# EasyEDA Pro project OctoSlime_Base_Unit_Light.eprj

# Schematic Octoslime

## Sheets
1 I2C breakout and OLED
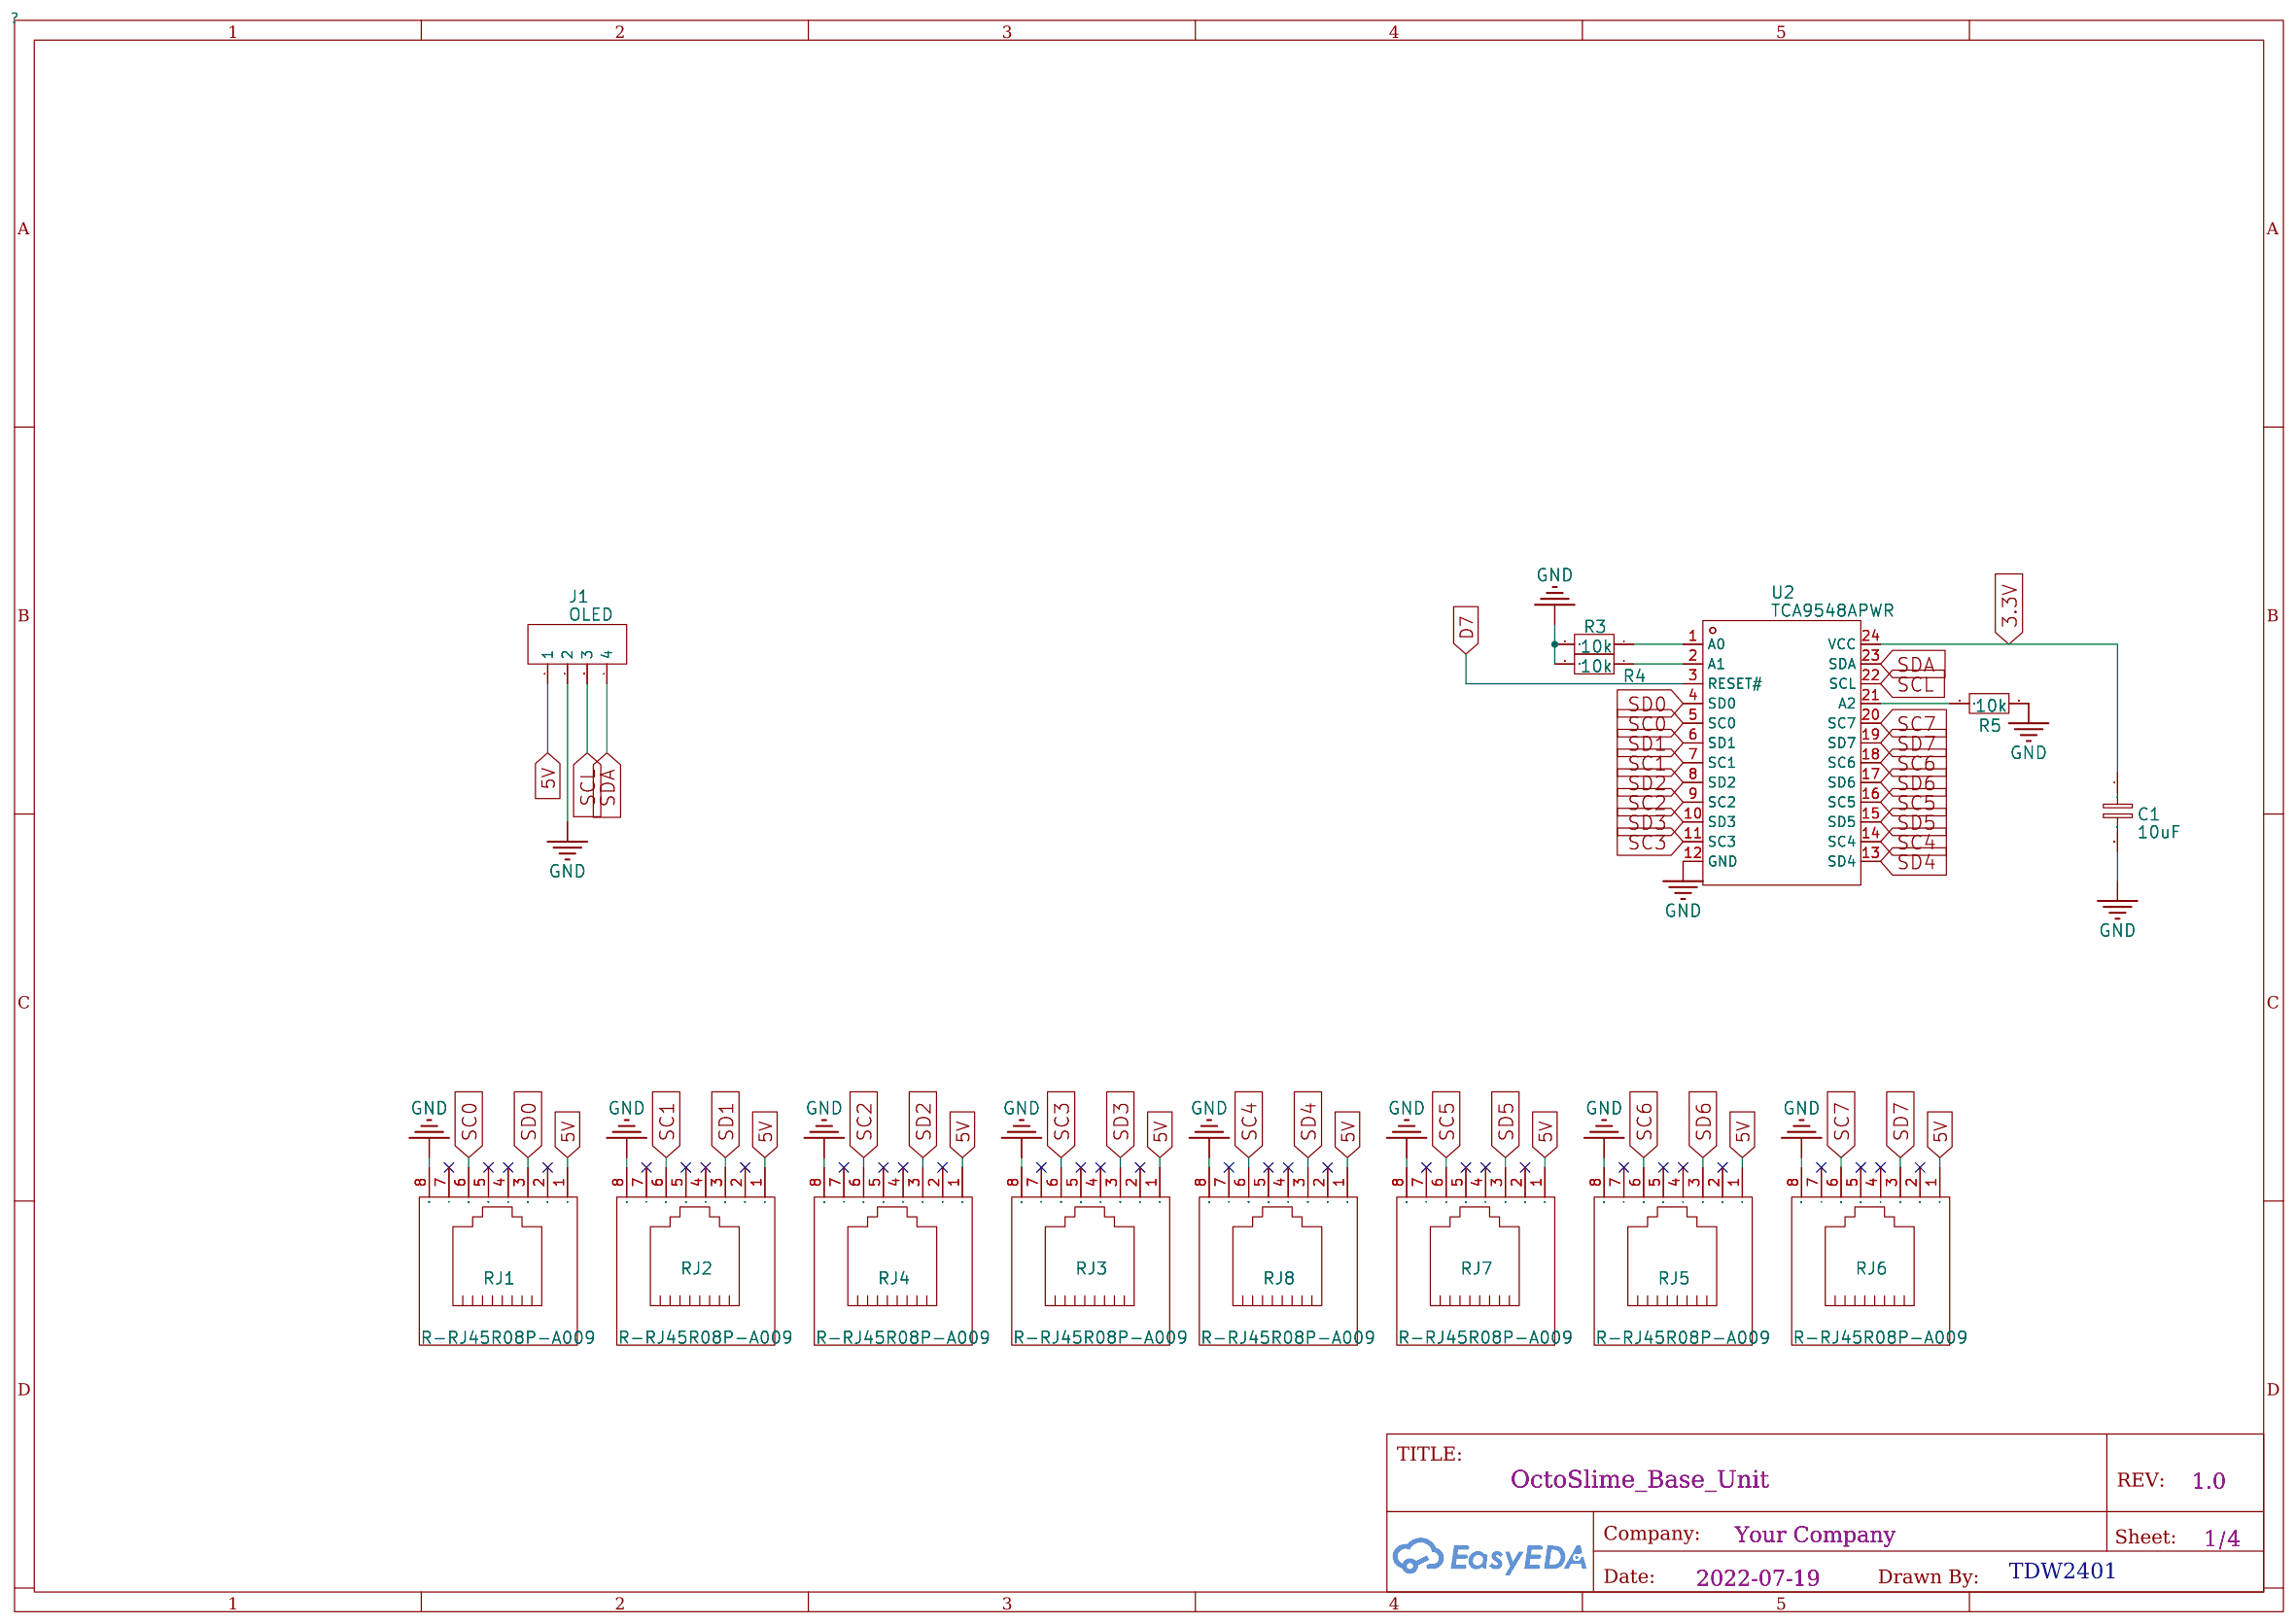
[diagram p0: I2C breakout and OLED]
2 Charge / data
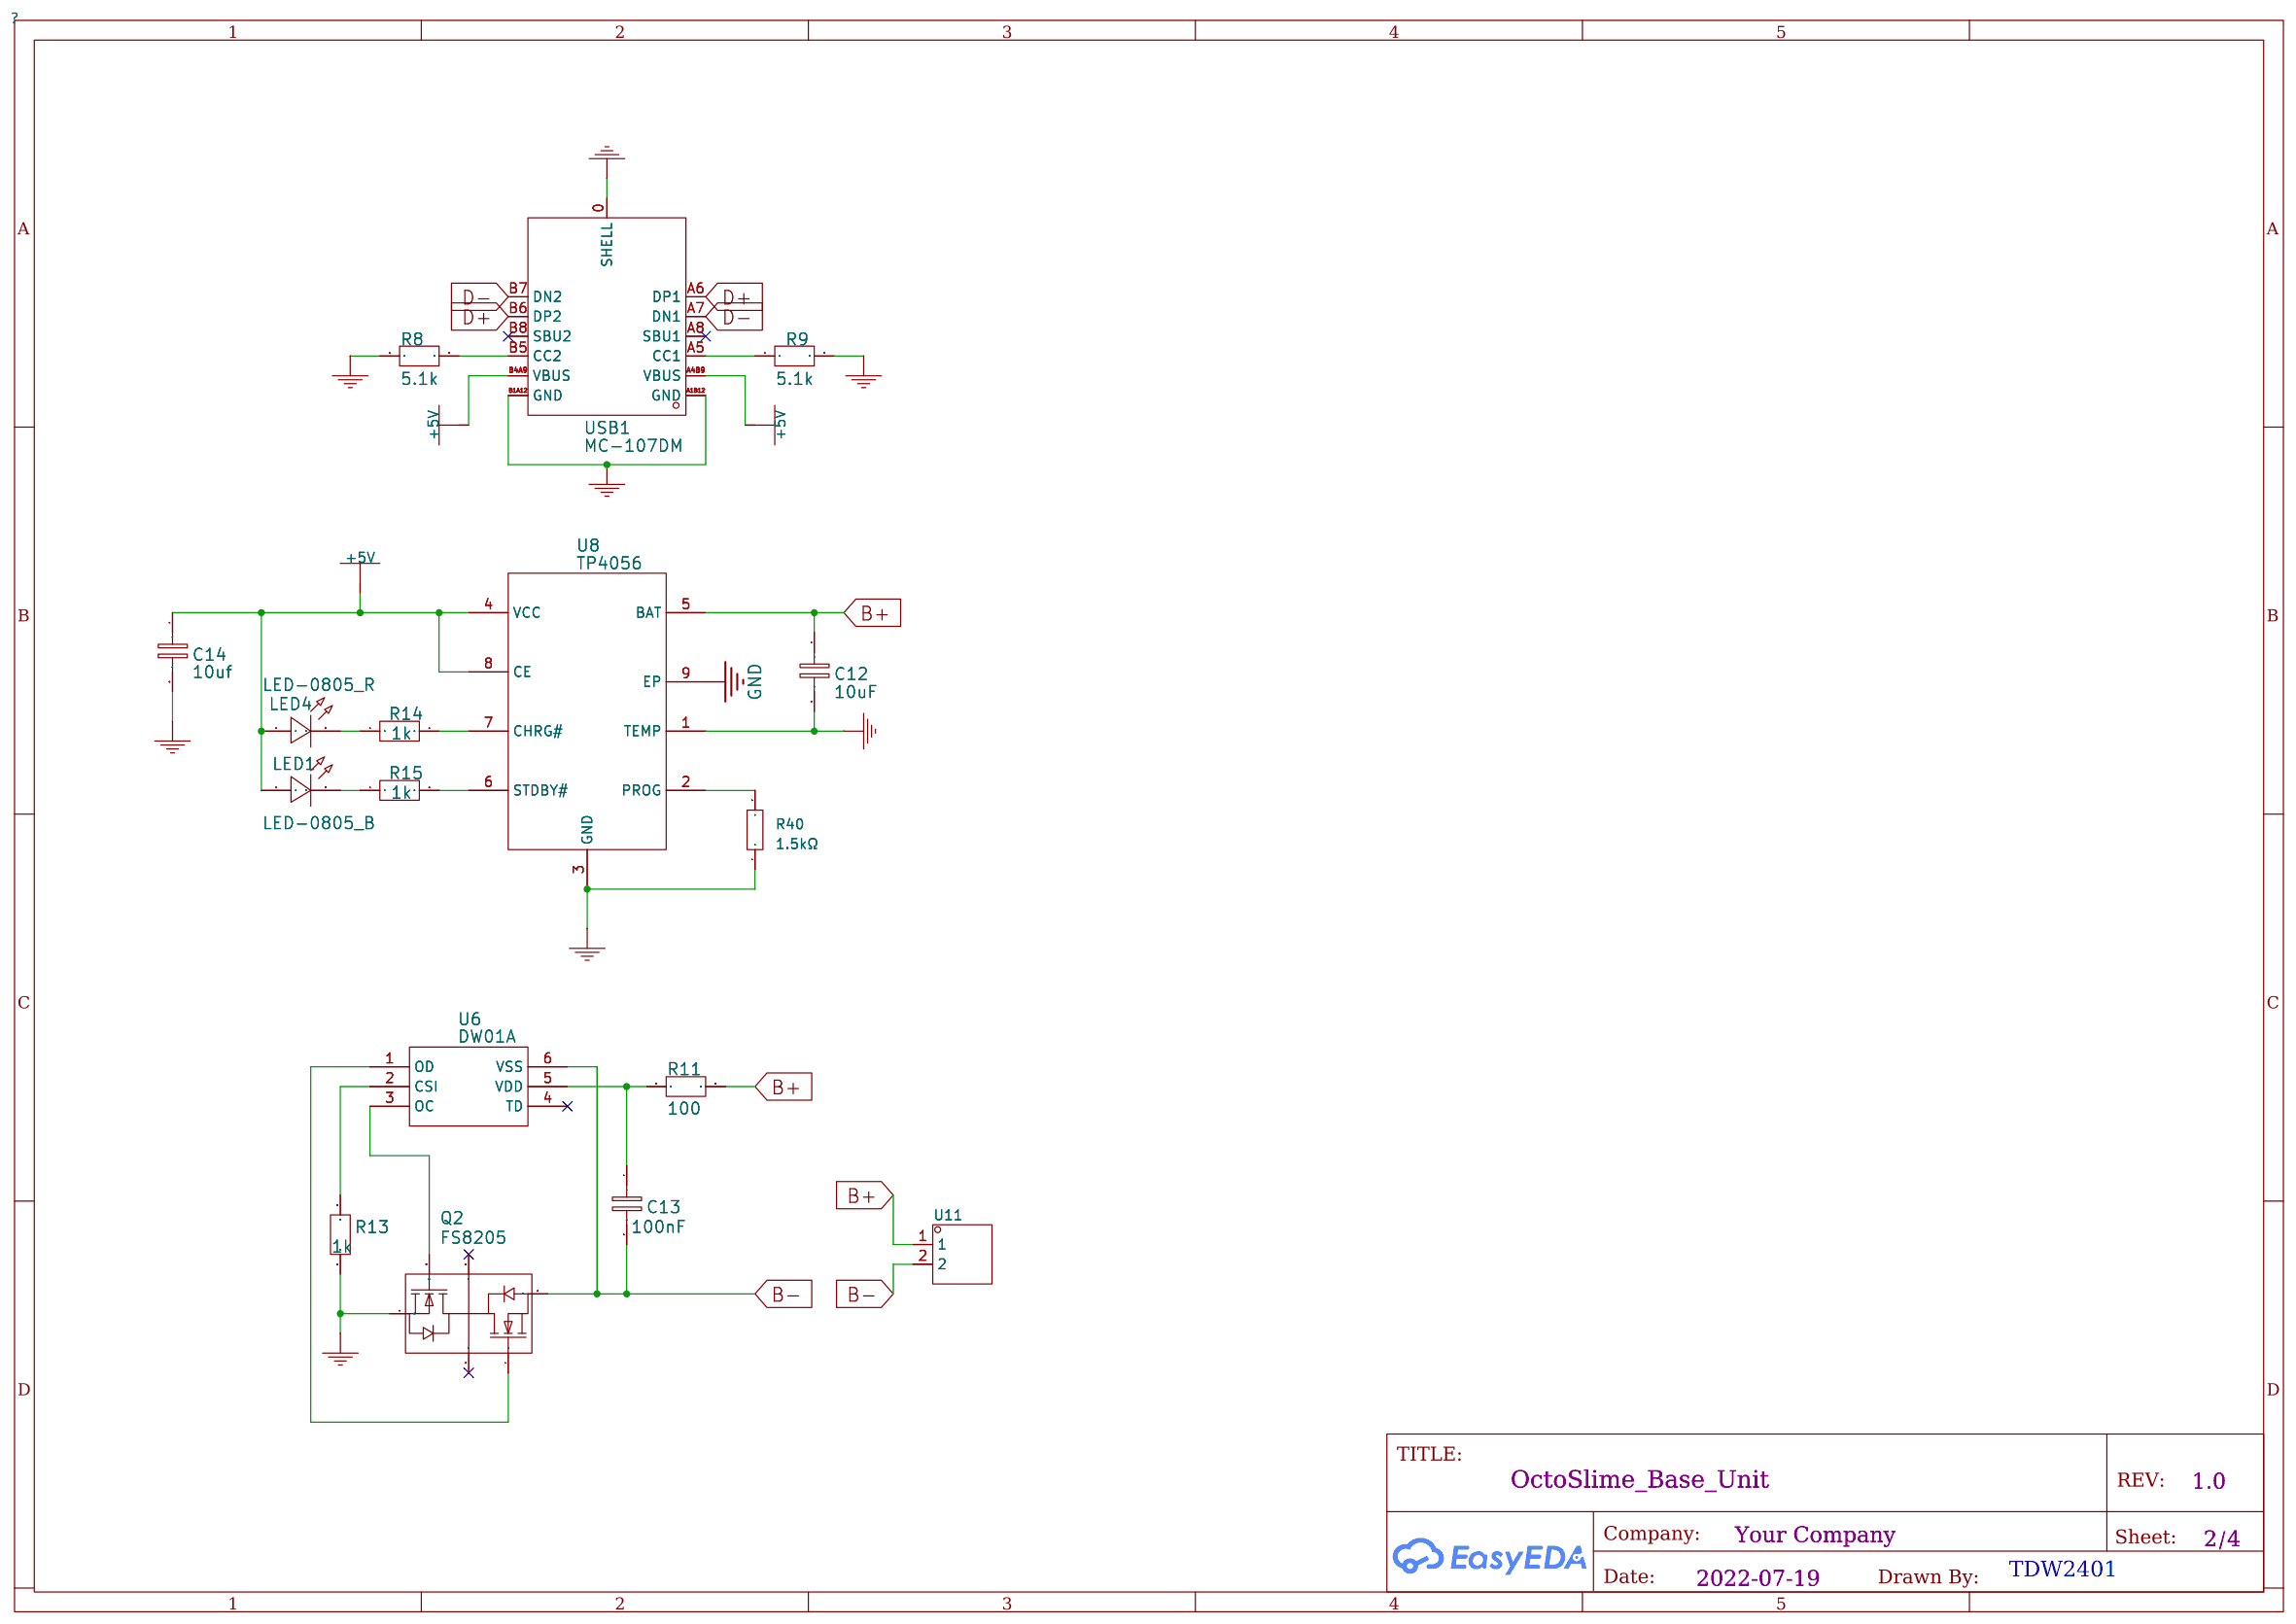
[diagram p1: Charge / data]
3 MCU
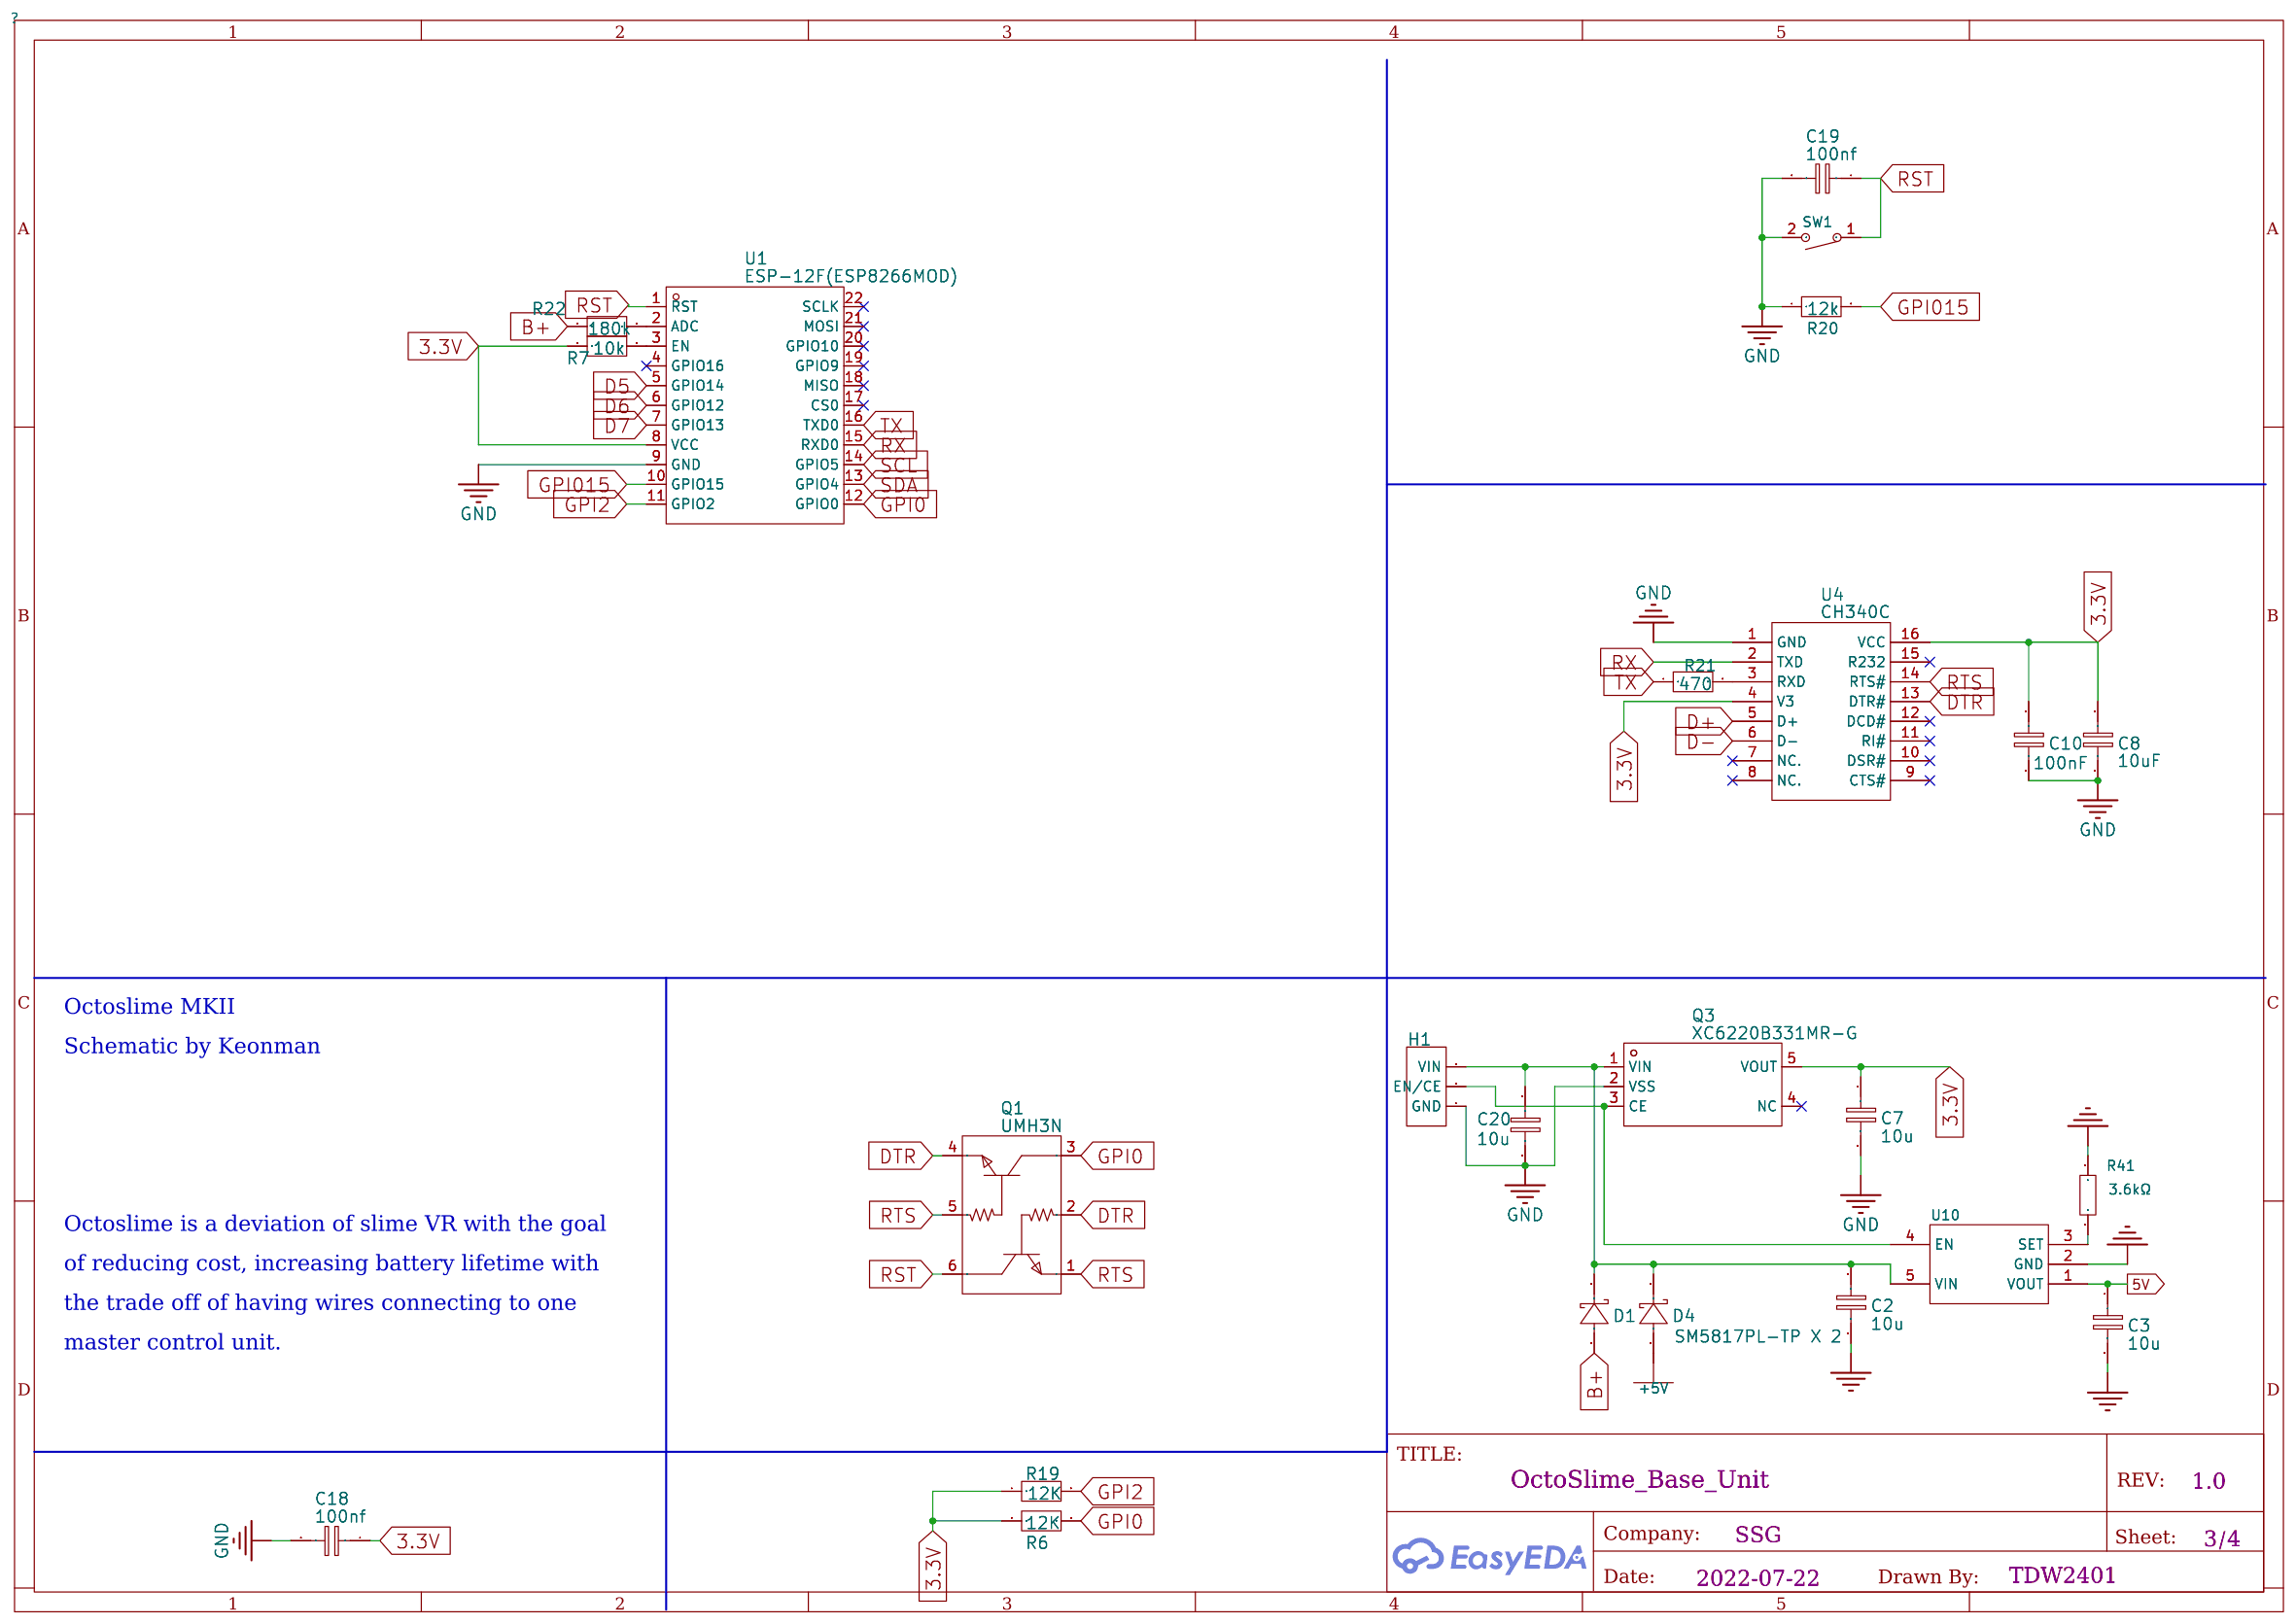
[diagram p2: MCU]
4 I2C thing - ma - jigXC6220B331PR-G
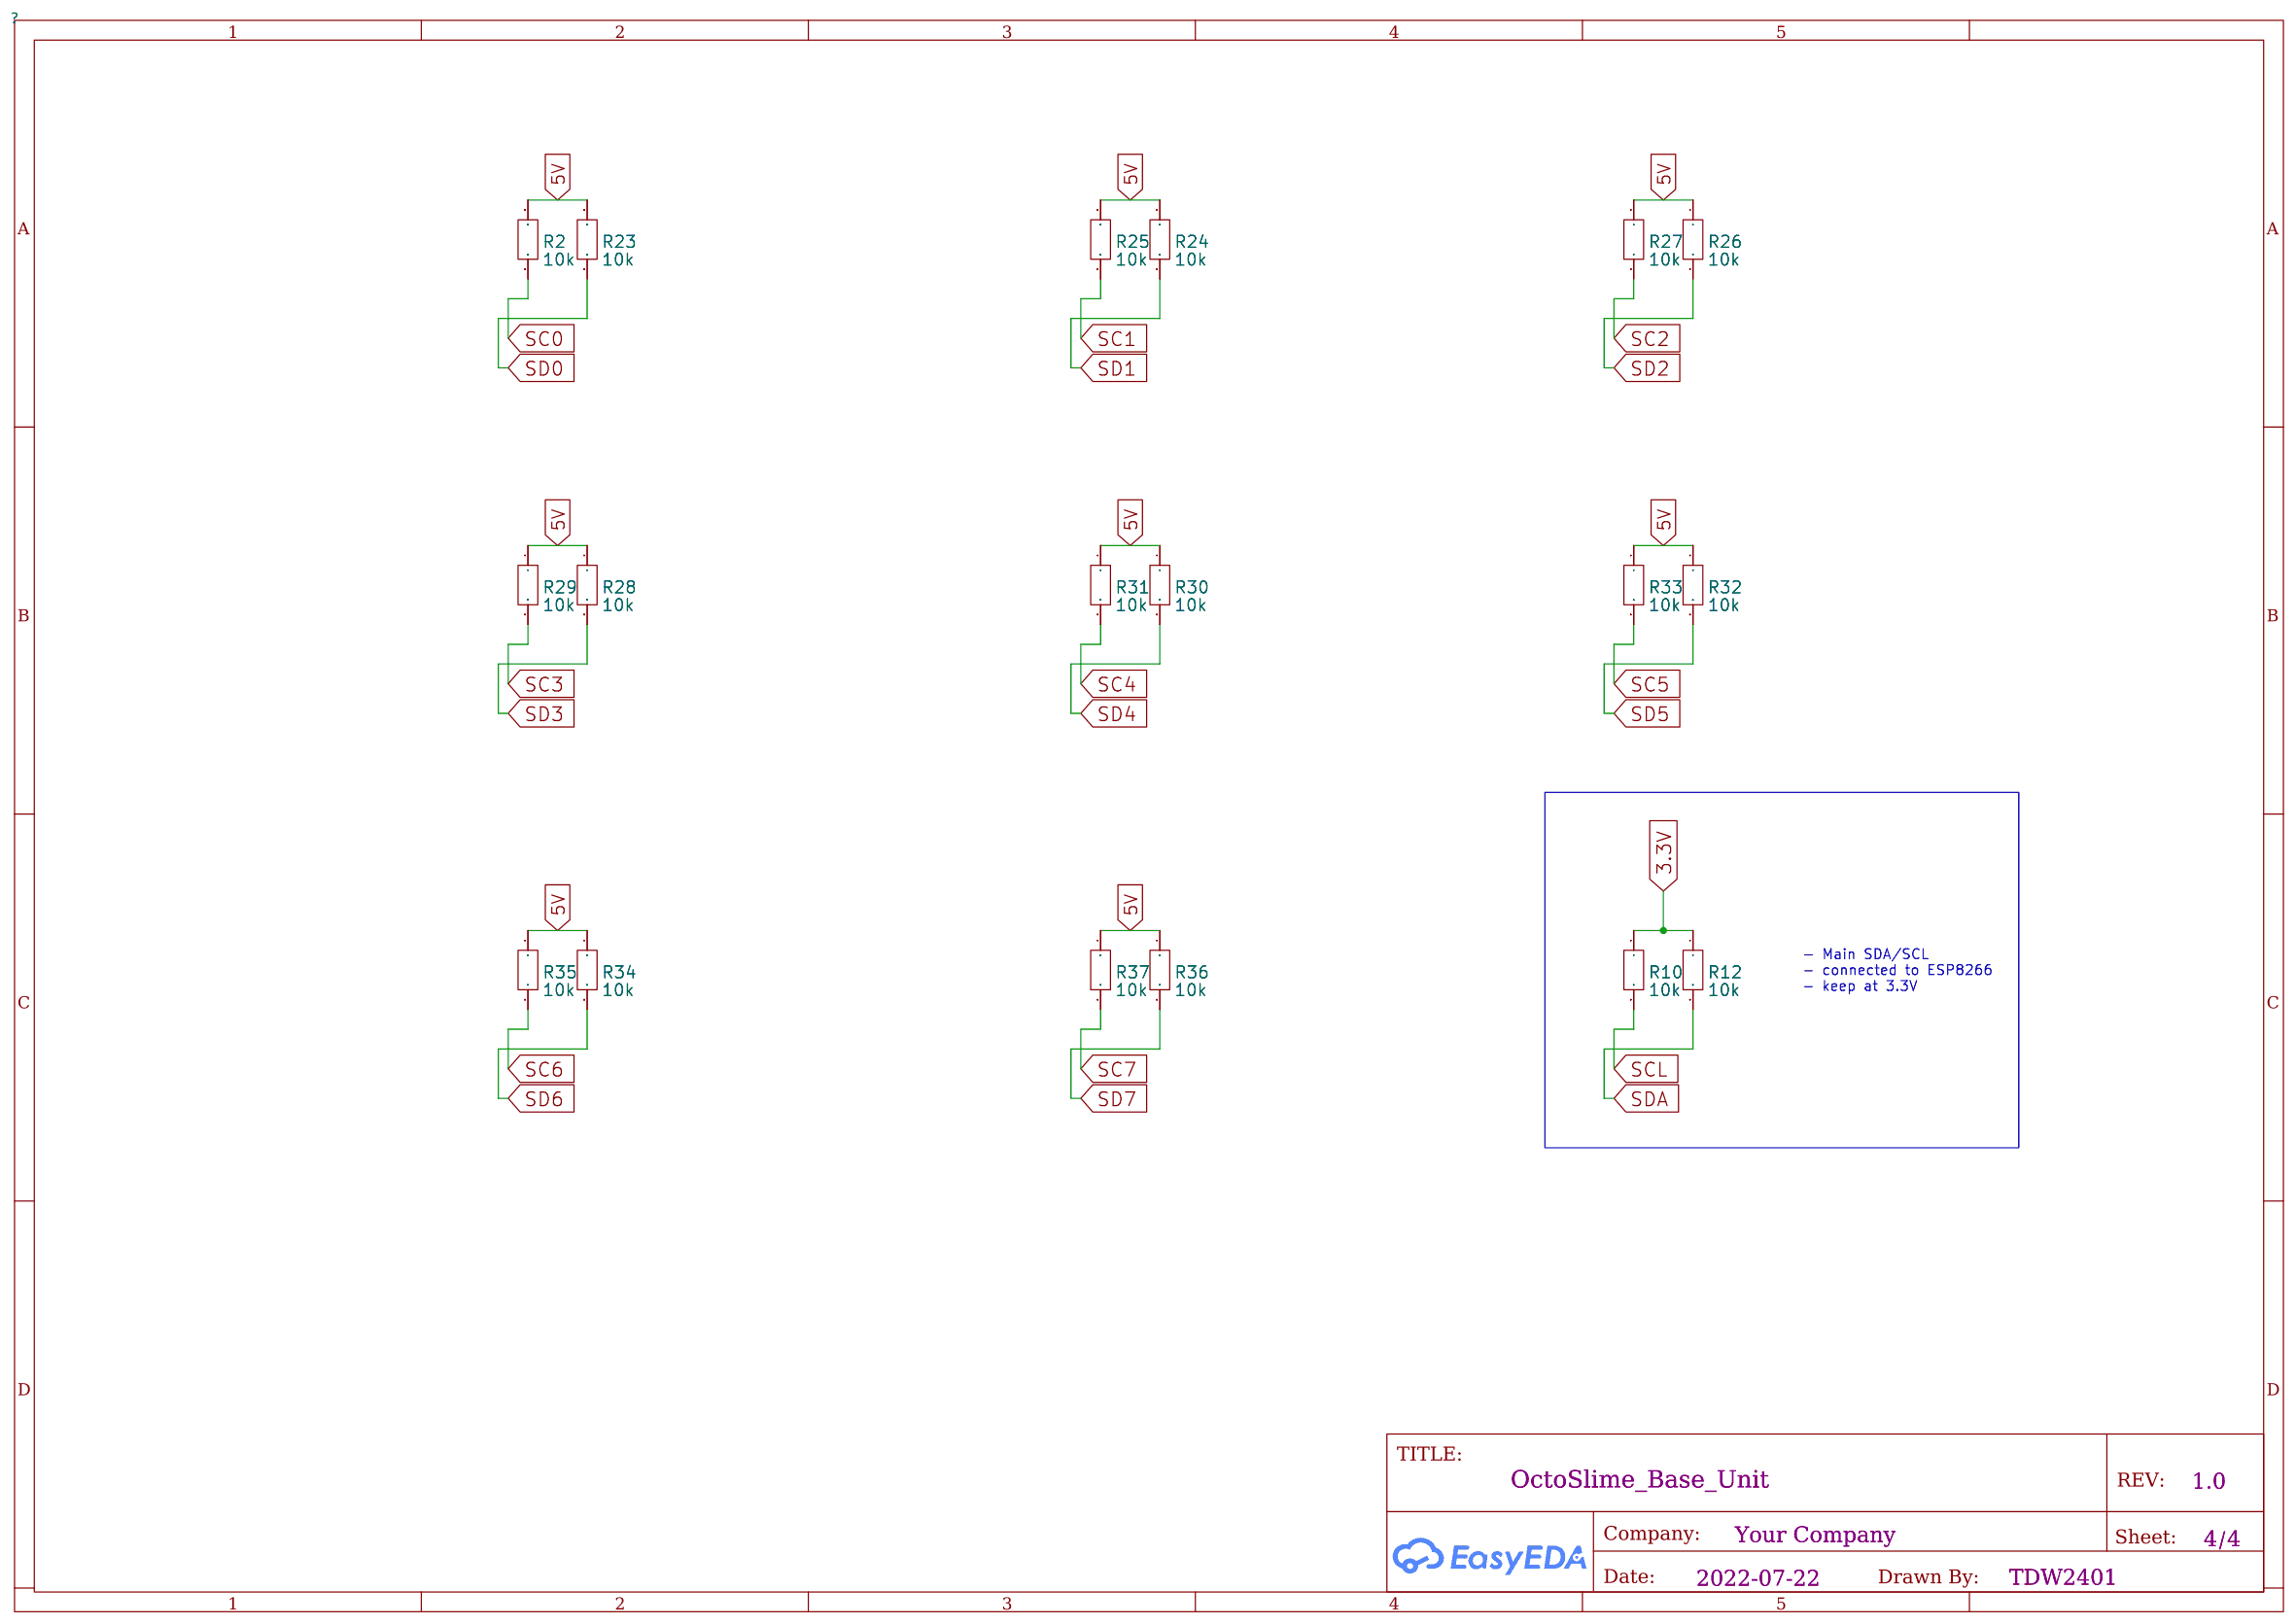
[diagram p3: I2C thing - ma - jigXC6220B331PR-G]

## Parts
sheet Charge / data
C12  10uF  [C0805]
C13  100nF  [C0805]
C14  10uf  [C0805]
LED1  LED-0805_B  [LED0805_BLUE]
LED4  LED-0805_R  [LED0805_RED]
Q2  FS8205  [SOT-23-6_L2.9-W1.6-P0.95-LS2.8-BR]
R8  5.1k  [R0805]
R9  5.1k  [R0805]
R11  100  [R0805]
R13  1k  [R0805]
R14  1k  [R0805]
R15  1k  [R0805]
R40  1.5kΩ  [R0805]
U6  DW01A  [SOT-23-6_L2.9-W1.6-P0.95-LS2.8-BL]
U8  TP4056  [ESOP-8_L4.9-W3.9-P1.27-LS6.0-BL-EP]
U11  S2B-PH-K-S(LF)(SN)  [CONN-TH_S2B-PH-K-S-LF-SN]
USB1  MC-107DM  [USB-C-SMD_MC-107D]
sheet I2C breakout and OLED
C1  10uF  [C0805]
J1  OLED  [HDR-M-2.54_1X4]  (no BOM)
R3  10k  [R0805]
R4  10k  [R0805]
R5  10k  [R0805]
RJ1  R-RJ45R08P-A009  [RJ45-TH_R-RJ45R08P-A009]
RJ2  R-RJ45R08P-A009  [RJ45-TH_R-RJ45R08P-A009]
RJ3  R-RJ45R08P-A009  [RJ45-TH_R-RJ45R08P-A009]
RJ4  R-RJ45R08P-A009  [RJ45-TH_R-RJ45R08P-A009]
RJ5  R-RJ45R08P-A009  [RJ45-TH_R-RJ45R08P-A009]
RJ6  R-RJ45R08P-A009  [RJ45-TH_R-RJ45R08P-A009]
RJ7  R-RJ45R08P-A009  [RJ45-TH_R-RJ45R08P-A009]
RJ8  R-RJ45R08P-A009  [RJ45-TH_R-RJ45R08P-A009]
U2  TCA9548APWR  [TSSOP-24_L7.8-W4.4-P0.65-LS6.4-BL]
sheet I2C thing - ma - jigXC6220B331PR-G
R2  10k  [R0805]
R10  10k  [R0805]
R12  10k  [R0805]
R23  10k  [R0805]
R24  10k  [R0805]
R25  10k  [R0805]
R26  10k  [R0805]
R27  10k  [R0805]
R28  10k  [R0805]
R29  10k  [R0805]
R30  10k  [R0805]
R31  10k  [R0805]
R32  10k  [R0805]
R33  10k  [R0805]
R34  10k  [R0805]
R35  10k  [R0805]
R36  10k  [R0805]
R37  10k  [R0805]
sheet MCU
C2  10u  [C0805]
C3  10u  [C0805]
C7  10u  [C0805]
C8  10uF  [C0805]
C10  100nF  [C0805]
C18  100nf  [C0805]
C19  100nf  [C0805]
C20  10u  [C0805]
D1  SM5817PL-TP X 2  [SOD-123FL_L2.8-W1.7-LS3.6-RD]
D4  SM5817PL-TP X 2  [SOD-123FL_L2.8-W1.7-LS3.6-RD]
H1  HDR-F-2.54_1x3  [HDR-F-2.54_1X3]  (no BOM)
Q1  UMH3N  [SC-70-6_L2.2-W1.3-P0.65-LS2.1-BR]
Q3  XC6220B331MR-G  [SOT-25-5_L3.0-W1.8-P0.95-LS3.0-BR]
R6  12K  [R0805]
R7  10k  [R0805]
R19  12K  [R0805]
R20  12k  [R0805]
R21  470  [R0805]
R22  180k  [R0805]
R41  3.6kΩ  [R0805]
SW1  -  [SW-SMD_L4.0-W2.9-LS5.0]
U1  ESP-12F(ESP8266MOD)  [WIFIM-SMD_ESP-12F-ESP8266MOD]
U4  CH340C  [SOP-16_L10.0-W3.9-P1.27-LS6.0-BL]
U10  MT9700  [SOT-23-5_L3.0-W1.7-P0.95-LS2.8-BR]

## Library data of the parts
C1 C8 C12 = 10uF: link: https://item.szlcsc.com/373011.html; 3DModel: C0805_L2.0-W1.3-H1.3
C10 C13 = 100nF: link: https://item.szlcsc.com/373011.html; 3DModel: C0805_L2.0-W1.3-H1.3
C14 = 10uf: link: https://item.szlcsc.com/373011.html; 3DModel: C0805_L2.0-W1.3-H1.3
LED1 = LED-0805_B: 3DModel: LED0805_Blue; Manufacturer: 方舟 ARKLED; Manufacturer Part: D-B080508B1-KS2; Supplier Part: C108412
LED4 = LED-0805_R: 3DModel: LED0805_Red; Manufacturer: EVERLIGHT(台湾亿光); Manufacturer Part: 17-21SURC/S530-A3/TR8; Supplier Part: C72037
Q2 = FS8205: link: https://item.szlcsc.com/169042.html; 3DModel: SOT-23-6_L2.9-W1.6-H1.5-LS2.8-P0.95; Supplier: LCSC; Manufacturer: FORTUNE; Supplier Part: C32254; JLCPCB Part Class: Extended Part
R8 R9 = 5.1k: link: https://item.szlcsc.com/142685.html; 3DModel: R0805_L2.0-W1.3-H0.6
R11 = 100: link: https://item.szlcsc.com/142685.html; 3DModel: R0805_L2.0-W1.3-H0.6
R13-R15 = 1k: link: https://item.szlcsc.com/142685.html; 3DModel: R0805_L2.0-W1.3-H0.6
R40 = 0805W8F1501T5E: 电阻类型:厚膜电阻;阻值:1.5kΩ;精度:±1%;功率:125mW;温度系数:±100ppm/;最大工作电压:150V;工作温度范围:-55~+155;; LCSC Part Name: 1.5kΩ ±1% 125mW; Supplier Part: C4310; Manufacturer: UNI-ROYAL(厚声); Supplier Footprint: 0805; JLCPCB Part Class: Basic Part; Datasheet: https://atta.szlcsc.com/upload/public/pdf/source/20200306/C422600_1E6D84923E4A46A82E41ADD87F860B5C.pdf; Supplier: LCSC; Type: 厚膜电阻; Tolerance: ±1%; Power(Watts): 125mW; Temperature Coefficient: ±100ppm/; Overload Voltage (Max): 150V; Operating Temperature Range: -55~+155
U6 = DW01A: link: https://item.szlcsc.com/169042.html; 3DModel: SOT-23-6_L2.9-W1.6-H1.5-LS2.8-P0.95; Supplier: LCSC; Manufacturer: FM; Supplier Part: C85680; JLCPCB Part Class: Extended Part
U8 = TP4056: link: https://www.mornsun.cn/html/pdf/SCM1501B.html; 3DModel: ESOP-8_L4.9-W3.9-H1.6-LS6.0-P1.27; Supplier: LCSC; Manufacturer: TOPPOWER; Supplier Part: C16581; JLCPCB Part Class: Basic Part
U11 = S2B-PH-K-S(LF)(SN): 参考系列:PH;间距:2mm;插针结构:1x2P;排数:1;每排PIN数:2;行距:-;安装方式:-;触头材质:黄铜;; LCSC Part Name: PH系列插座 1*2P 间距2mm 弯针 打K; Supplier Part: C173752; Manufacturer: JST; Supplier Footprint: 插件,P=2mm; JLCPCB Part Class: Extended Part; Datasheet: https://atta.szlcsc.com/upload/public/pdf/source/20180327/C173752_5C91EDA4B54CB1D33BA17C4D2B983D44.pdf; Supplier: LCSC; Reference Series: PH; Pitch: 2mm; Pins Structure: 1x2P; Number of Rows: 1; Number of PINs Per Row: 2; Contact Material: 黄铜
USB1 = MC-107DM: link: https://atta.szlcsc.com/upload/public/pdf/source/20210810/6DD818F077A767CCD2FDFBDED48F58DC.pdf; Supplier: LCSC; Supplier Part: C2874569; Manufacturer: 台湾汉博; JLCPCB Part Class: Extended Part
J1 = OLED: 3DModel: HDR-M-2.54_1x4; Supplier Part: C124378; Supplier: LCSC
R2-R5 R7 R10 R12 R23-R37 = 10k: link: https://item.szlcsc.com/142685.html; 3DModel: R0805_L2.0-W1.3-H0.6
RJ1-RJ8 = R-RJ45R08P-A009: link: https://atta.szlcsc.com/upload/public/pdf/source/20211021/D54662BD8381AD1D1DF920996089EE18.pdf; Supplier: LCSC; Supplier Part: C2902700; Manufacturer: Ckmtw(灿科盟); JLCPCB Part Class: Extended Part
U2 = TCA9548APWR: link: https://item.szlcsc.com/6601.html; 3DModel: TSSOP-24_L7.8-W4.4-H1.0-LS6.4-P0.65; Supplier: LCSC; Manufacturer: TI; Supplier Part: C130026; JLCPCB Part Class: Extended Part
C2 C3 C7 C20 = 10u: link: https://item.szlcsc.com/373011.html; 3DModel: C0805_L2.0-W1.3-H1.3
C18 C19 = 100nf: link: https://item.szlcsc.com/373011.html; 3DModel: C0805_L2.0-W1.3-H1.3
D1 D4 = SM5817PL-TP X 2: link: https://item.szlcsc.com/771782.html; Supplier: LCSC; Supplier Part: C669022; Manufacturer: MCC(Micro Commercial Components); Manufacturer Part: SM5817PL-TP; JLCPCB Part Class: Extended Part
H1 = HDR-F-2.54_1x3: link: https://www.cjt.com/Upload/A2541.pdf; Supplier Part: C146690; Supplier: LCSC
Q1 = UMH3N: link: https://item.szlcsc.com/112963.html; 3DModel: SC-70-6_L2.1-W1.3-H1.0-LS2.1-P0.65; Supplier: LCSC; Manufacturer: CJ; Supplier Part: C62892; JLCPCB Part Class: Extended Part
Q3 = XC6220B331MR-G: link: https://item.szlcsc.com/70677.html; 3DModel: SOT-25-5_L3.0-W1.6-H1.3-LS2.8-P0.95; Supplier: LCSC; Manufacturer: TOREX; Supplier Part: C86534; JLCPCB Part Class: Extended Part
R6 R19 = 12K: link: https://item.szlcsc.com/142685.html; 3DModel: R0805_L2.0-W1.3-H0.6
R20 = 12k: link: https://item.szlcsc.com/142685.html; 3DModel: R0805_L2.0-W1.3-H0.6
R21 = 470: link: https://item.szlcsc.com/142685.html; 3DModel: R0805_L2.0-W1.3-H0.6
R22 = 180k: link: https://item.szlcsc.com/142685.html; 3DModel: R0805_L2.0-W1.3-H0.6
R41 = 0805W8F3601T5E: 电阻类型:厚膜电阻;阻值:3.6kΩ;精度:±1%;功率:1/8W;温度系数:±100ppm/;最大工作电压:150V;工作温度范围:-55~+155;; LCSC Part Name: 3.6kΩ ±1%; Supplier Part: C18359; Manufacturer: UNI-ROYAL(厚声); Supplier Footprint: 0805; JLCPCB Part Class: Basic Part; Datasheet: https://atta.szlcsc.com/upload/public/pdf/source/20200306/C422600_1E6D84923E4A46A82E41ADD87F860B5C.pdf; Supplier: LCSC; Type: 厚膜电阻; Tolerance: ±1%; Power(Watts): 1/8W; Temperature Coefficient: ±100ppm/; Overload Voltage (Max): 150V; Operating Temperature Range: -55~+155
SW1 = TS342A2P-WZ: LCSC Part Name: 轻触开关 3*4*2 两脚小龟不带柱 250gf 黑色塑胶按钮; Supplier Part: C557591; Manufacturer: SHOU HAN(首韩); Supplier Footprint: SMD; JLCPCB Part Class: Extended Part; Datasheet: https://atta.szlcsc.com/upload/public/pdf/source/20200519/C557591_B3A5A21584733303F06306F18577DA8B.pdf; Supplier: LCSC
U1 = ESP-12F(ESP8266MOD): link: https://item.szlcsc.com/84052.html; 3DModel: WIFIM-SMD_WIFI-L24.0-W16.0-H3.1; Supplier: LCSC; Manufacturer: Ai-Thinker; Supplier Part: C82891; JLCPCB Part Class: Extended Part
U4 = CH340C: link: https://item.szlcsc.com/391677.html; Supplier Part: C84681; Supplier: LCSC; 3DModel: SOP-16_L9.9-W3.9-H1.5-LS6.0-P1.27; Manufacturer: WCH; JLCPCB Part Class: Extended Part
U10 = MT9700: 低功耗负载开关/USB电源开关/限流保护开关; Supplier Part: C89855; Manufacturer: 西安航天民芯; Supplier Footprint: SOT-23-5; JLCPCB Part Class: Extended Part; Datasheet: https://atta.szlcsc.com/upload/public/pdf/source/20170418/1492481333031.pdf; Supplier: LCSC

## Nets
3.3V: C1.1 C7.1 C8.1 C10.1 C18.1 Q3.5(VOUT) R6.1 R7.1 R10.1 R12.1 R19.1 U1.8(VCC) U2.24(VCC) U4.4(V3) U4.16(VCC)
5V: C3.1 J1.1 R2.1 R23.1 R24.1 R25.1 R26.1 R27.1 R28.1 R29.1 R30.1 R31.1 R32.1 R33.1 R34.1 R35.1 R36.1 R37.1 RJ1.1 RJ2.1 RJ3.1 RJ4.1 RJ5.1 RJ6.1 RJ7.1 RJ8.1 U10.1(VOUT)
+5V: C14.1 D4.2(A) LED1.1 LED4.1 U8.4(VCC) U8.8(CE) USB1.A4B9(VBUS) USB1.B4A9(VBUS)
GND: C1.2 C2.2 C3.2 C7.2 C8.2 C10.2 C12.2 C14.2 C18.2 C19.2 C20.2 H1.1(GND) J1.2 Q2.1(S1) Q3.2(VSS) R3.2 R4.2 R5.1 R8.1 R9.2 R13.2 R20.1 R40.1 R41.2 RJ1.8 RJ2.8 RJ3.8 RJ4.8 RJ5.8 RJ6.8 RJ7.8 RJ8.8 SW1.2 U1.9(GND) U2.12(GND) U4.1(GND) U8.1(TEMP) U8.3(GND) U8.9(EP) U10.2(GND) USB1.0(SHELL) USB1.A1B12(GND) USB1.B1A12(GND)
B+: C12.1 D1.2(A) R11.2 R22.1 U8.5(BAT) U11.1
B-: C13.2 Q2.3(S2) U6.6(VSS) U11.2
CHRG#: R14.2 U8.7(CHRG#)
D5: U1.5(GPIO14)
D6: U1.6(GPIO12)
D7: U1.7(GPIO13) U2.3(RESET#)
D+: U4.5(D+) USB1.A6(DP1) USB1.B6(DP2)
D-: U4.6(D-) USB1.A7(DN1) USB1.B7(DN2)
DTR: Q1.2(B) Q1.4(E) U4.13(DTR#)
GPI0: Q1.3(C) R6.2 U1.12(GPIO0)
GPI2: R19.2 U1.11(GPIO2)
GPI015: R20.2 U1.10(GPIO15)
RPROG: R40.2 U8.2(PROG)
RST: C19.1 Q1.6(C) SW1.1 U1.1(RST)
RTS: Q1.1(E) Q1.5(B) U4.14(RTS#)
RX: U1.15(RXD0) U4.2(TXD)
SC0: R2.2 RJ1.6 U2.5(SC0)
SC1: R25.2 RJ2.6 U2.7(SC1)
SC2: R27.2 RJ4.6 U2.9(SC2)
SC3: R29.2 RJ3.6 U2.11(SC3)
SC4: R31.2 RJ8.6 U2.14(SC4)
SC5: R33.2 RJ7.6 U2.16(SC5)
SC6: R35.2 RJ5.6 U2.18(SC6)
SC7: R37.2 RJ6.6 U2.20(SC7)
SCL: J1.3 R10.2 U1.14(GPIO5) U2.22(SCL)
SD0: R23.2 RJ1.3 U2.4(SD0)
SD1: R24.2 RJ2.3 U2.6(SD1)
SD2: R26.2 RJ4.3 U2.8(SD2)
SD3: R28.2 RJ3.3 U2.10(SD3)
SD4: R30.2 RJ8.3 U2.13(SD4)
SD5: R32.2 RJ7.3 U2.15(SD5)
SD6: R34.2 RJ5.3 U2.17(SD6)
SD7: R36.2 RJ6.3 U2.19(SD7)
SDA: J1.4 R12.2 U1.13(GPIO4) U2.23(SDA)
STDBY#: R15.2 U8.6(STDBY#)
TX: R21.1 U1.16(TXD0)
$1N65: R4.1 U2.2(A1)
$1N66: R3.1 U2.1(A0)
$1N67: R5.2 U2.21(A2)
$2N78: R8.2 USB1.B5(CC2)
$2N79: R9.1 USB1.A5(CC1)
$2N179: LED1.2 R15.1
$2N191: LED4.2 R14.1
$2N237: Q2.6(G1) U6.3(OC)
$2N238: Q2.4(G2) U6.1(OD)
$2N249: C13.1 R11.1 U6.5(VDD)
$2N267: R13.1 U6.2(CSI)
$3N452: R7.2 U1.3(EN)
$3N457: R21.2 U4.3(RXD)
$3N474: R22.2 U1.2(ADC)
$3N12959: H1.2(EN/CE) Q3.3(CE) U10.4(EN)
$3N13001: C2.1 C20.1 D1.1(C) D4.1(C) H1.3(VIN) Q3.1(VIN) U10.5(VIN)
$3N14474: R41.1 U10.3(SET)

Not connected (* = marked no-connect by the designer): Q2 2(D12)* 5(D12)*; Q3 4(NC)*; RJ1 2* 4* 5* 7*; RJ2 2* 4* 5* 7*; RJ3 2* 4* 5* 7*; RJ4 2* 4* 5* 7*; RJ5 2* 4* 5* 7*; RJ6 2* 4* 5* 7*; RJ7 2* 4* 5* 7*; RJ8 2* 4* 5* 7*; U1 4(GPIO16)* 17(CS0)* 18(MISO)* 19(GPIO9)* 20(GPIO10)* 21(MOSI)* 22(SCLK)*; U4 7(NC.)* 8(NC.)* 9(CTS#)* 10(DSR#)* 11(RI#)* 12(DCD#)* 15(R232)*; U6 4(TD)*; USB1 A8(SBU1)* B8(SBU2)*

## Notes on the sheets
sheet 1
- TDW2401
sheet 2
- TDW2401
sheet 3
- Octoslime MKII
- Schematic by Keonman
- Octoslime is a deviation of slime VR with the goal
- of reducing cost, increasing battery lifetime with
- the trade off of having wires connecting to one
- master control unit.
sheet 4
- - Main SDA/SCL
  - connected to ESP8266
  - keep at 3.3V

# Board PCB_PCB_Octoslime_3_2022-08-10_PCB
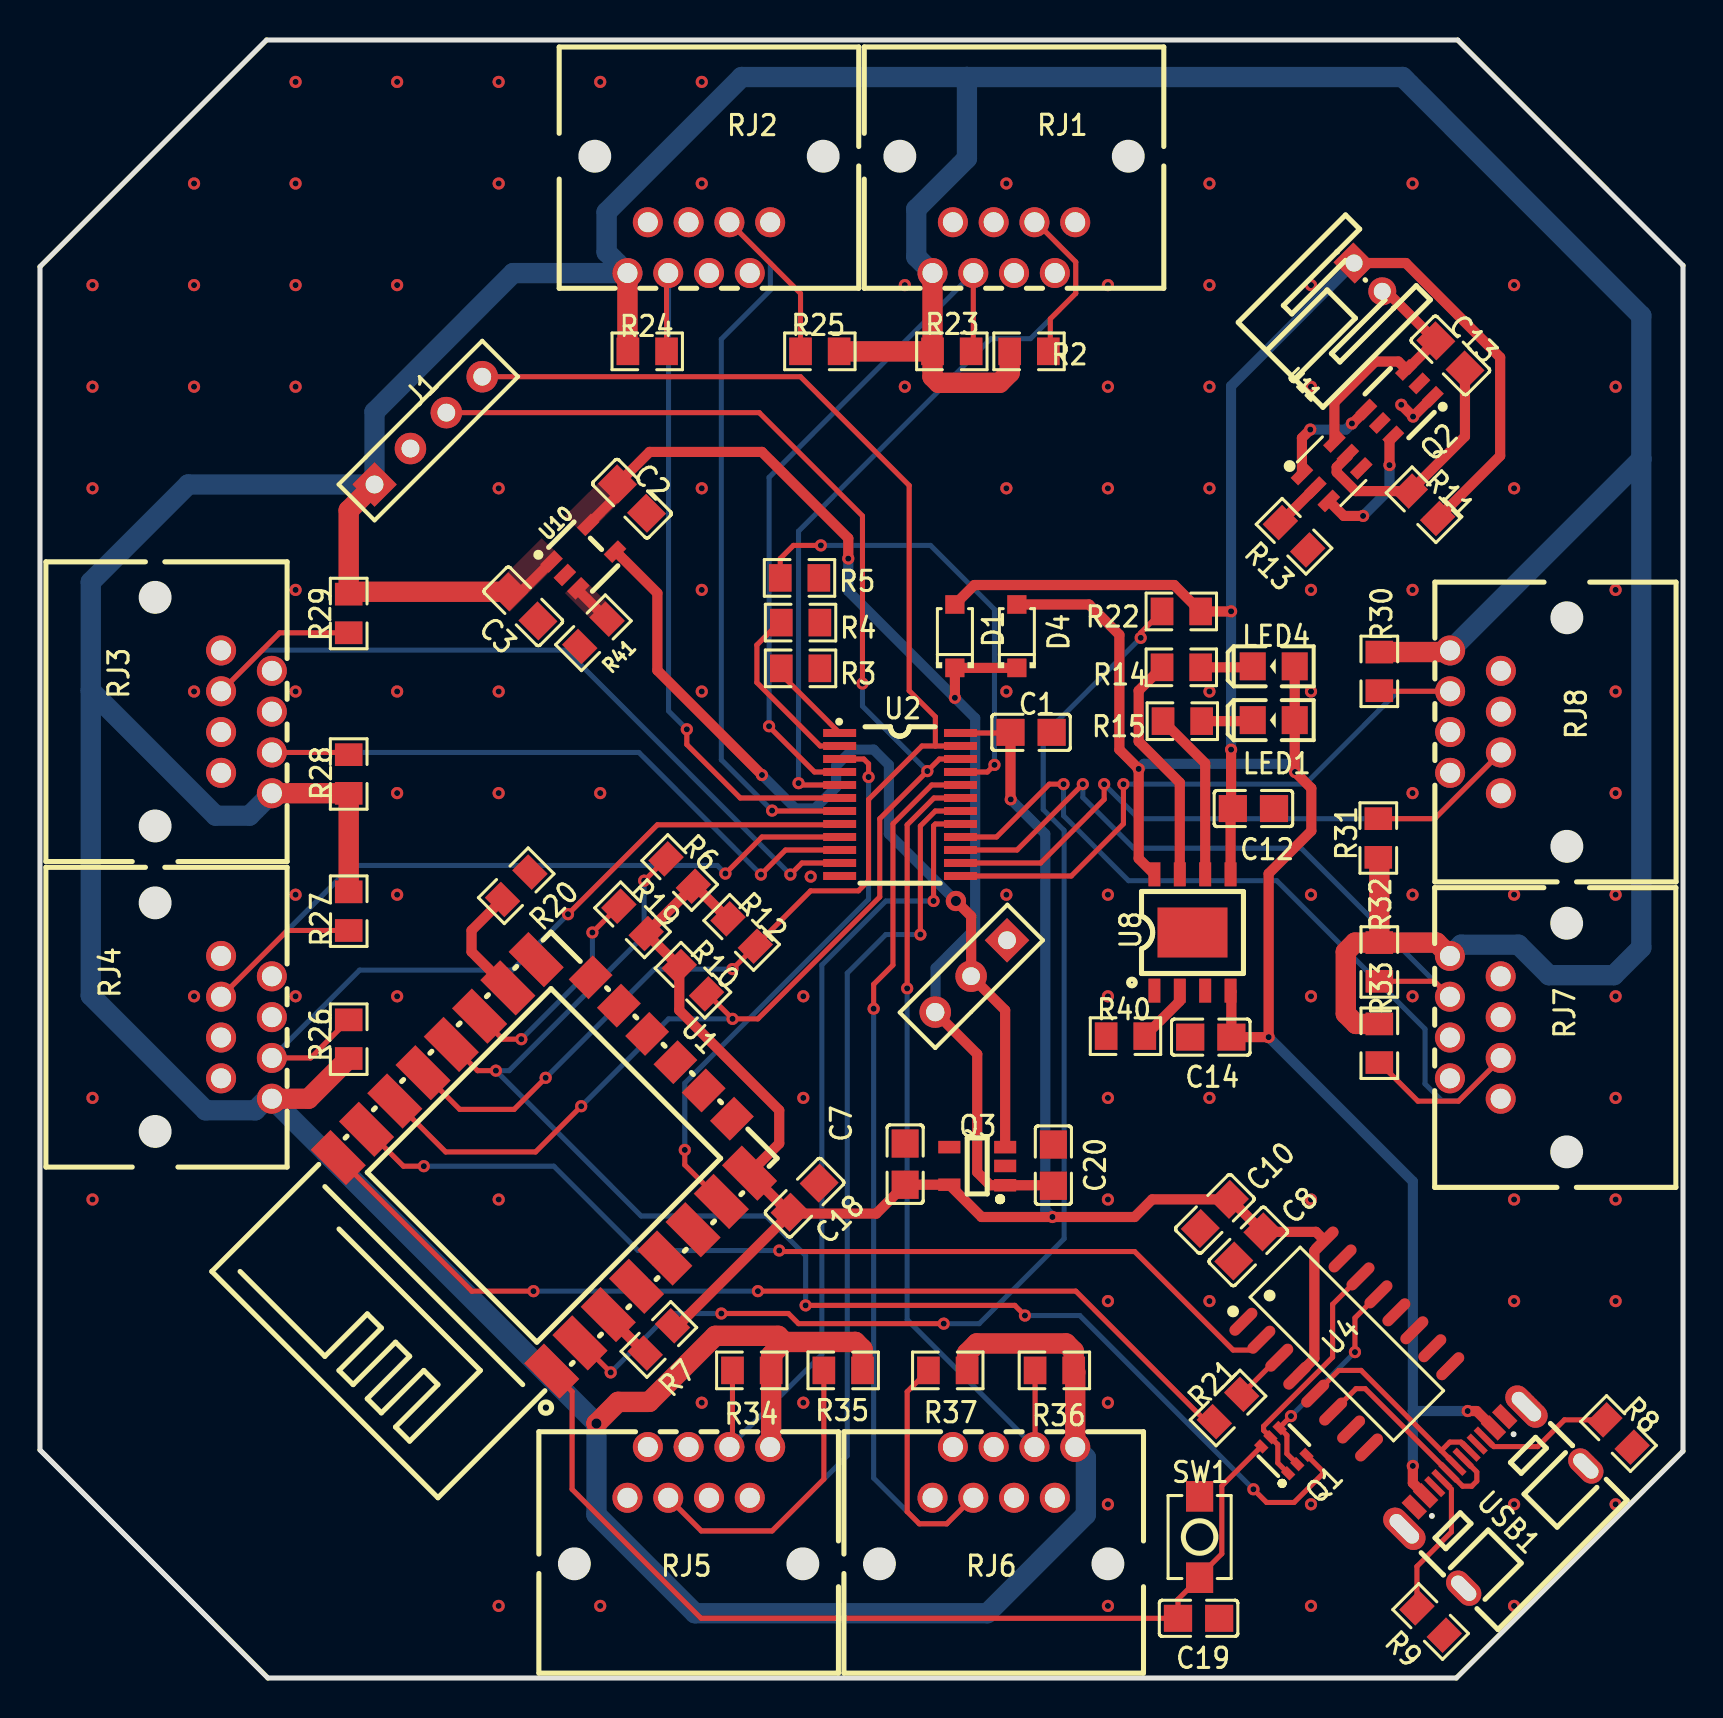
[diagram p4: board, top side]
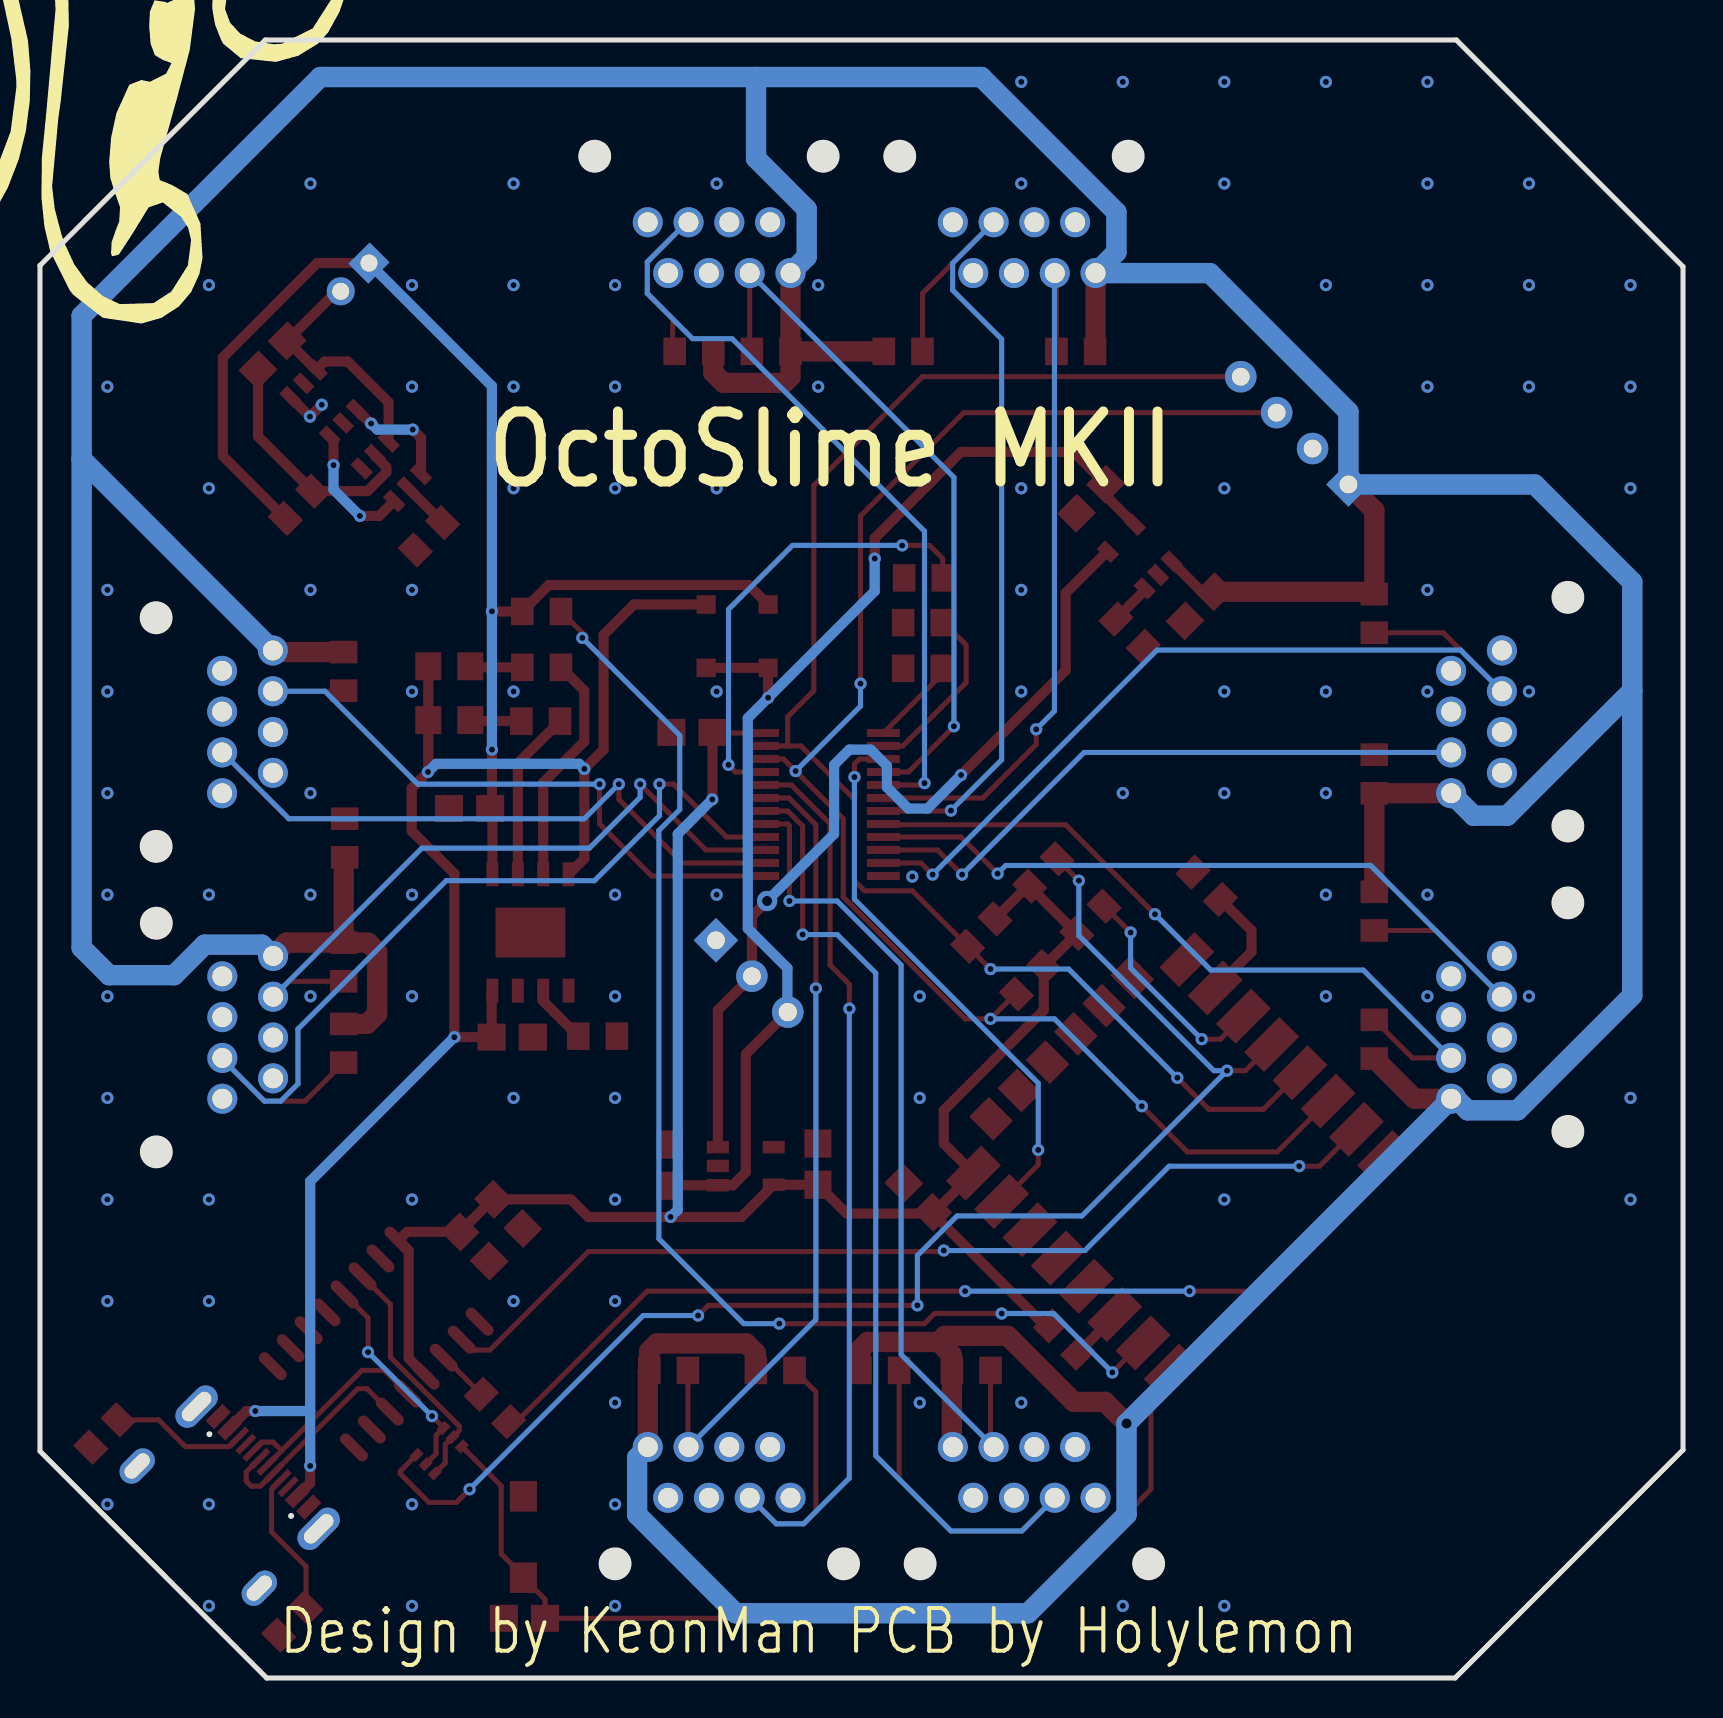
[diagram p5: board, bottom side, seen from below]

Outline 82.2 x 81.9 mm; copper layers: Top Layer, Bottom Layer. Coordinates in mm from the lower left corner of the outline.
Outline path: 0,70.56 11.34,81.9 70.92,81.9 82.2,70.62 82.2,11.34 70.86,0 11.4,0 0,11.4 0,70.56
Stack: Top Layer 0.035mm / Dielectric1 1.51mm FR4 er 4.5 / Bottom Layer 0.035mm

## Design rules (mm)
net D-: DP1
net D+: DP1
spacing Default (default): track to track 0.152, other pairs 0 to 0.152
track width Default (default): min 0.254, default 0.254, max 25.4
differential pair differentialPair (default): width min 0.127, default 0.254, max 2.54; gap min 0.152, default 0.152
via Default (default): diameter min 0.61, default 0.61, max 100.025; hole min 0.305, default 0.305, max 59.995
net $3N13001 uses copperRegion1
net $3N14474 uses copperRegion1
net 5V uses copperRegion1

## Placement (name value [footprint] x y rotation side)
C1  10uF  [C0805]  49.58 47.28 0 top
C2  10u  [C0805]  29.62 58.97 315 top
C3  10u  [C0805]  24.18 53.58 315 top
C7  10u  [C0805]  43.28 25.69 90 top
C8  10uF  [C0805]  60.45 21.58 225 top
C10  100nF  [C0805]  58.78 23.2 225 top
C12  10uF  [C0805]  60.71 43.47 0 top
C13  100nF  [C0805]  70.56 66.13 135 top
C14  10uf  [C0805]  58.57 32.04 180 top
C18  100nf  [C0805]  38.25 24.02 45 top
C19  100nf  [C0805]  57.96 2.99 0 top
C20  10u  [C0805]  50.7 25.64 90 top
D1  SM5817PL-TP X 2  [SOD-123FL_L2.8-W1.7-LS3.6-RD]  45.77 52.09 90 top
D4  SM5817PL-TP X 2  [SOD-123FL_L2.8-W1.7-LS3.6-RD]  48.87 52.09 90 top
H1  HDR-F-2.54_1x3  [HDR-F-2.54_1X3]  46.59 35.09 225 top
J1  OLED  [HDR-M-2.54_1X4]  19.43 62.37 45 top
LED1  LED-0805_B  [LED0805_BLUE]  61.72 47.89 180 top
LED4  LED-0805_R  [LED0805_RED]  61.72 50.58 180 top
Q1  UMH3N  [SC-70-6_L2.2-W1.3-P0.65-LS2.1-BR]  62.23 11.37 315 top
Q2  FS8205  [SOT-23-6_L2.9-W1.6-P0.95-LS2.8-BR]  68.02 63.74 45 top
Q3  XC6220B331MR-G  [SOT-25-5_L3.0-W1.8-P0.95-LS3.0-BR]  46.89 25.59 0 top
R2  10k  [R0805]  49.48 66.33 0 top
R3  10k  [R0805]  38.05 50.48 0 top
R4  10k  [R0805]  38.05 52.77 0 top
R5  10k  [R0805]  38 55 180 top
R6  12K  [R0805]  32 40.27 135 top
R7  10k  [R0805]  30.96 16.93 225 top
R8  5.1k  [R0805]  78.97 12.22 135 top
R9  5.1k  [R0805]  69.57 2.82 315 top
R10  10k  [R0805]  32.67 34.89 315 top
R11  100  [R0805]  69.24 58.66 315 top
R12  10k  [R0805]  35.1 37.28 315 top
R13  1k  [R0805]  62.74 57.09 315 top
R14  1k  [R0805]  57.1 50.53 180 top
R15  1k  [R0805]  57.15 47.84 180 top
R19  12K  [R0805]  29.65 37.91 135 top
R20  12k  [R0805]  23.83 39.61 225 top
R21  470  [R0805]  59.44 13.5 45 top
R22  180k  [R0805]  57.1 53.33 180 top
R23  10k  [R0805]  45.62 66.33 0 top
R24  10k  [R0805]  30.38 66.33 0 top
R25  10k  [R0805]  39.02 66.33 180 top
R26  10k  [R0805]  15.44 31.94 90 top
R27  10k  [R0805]  15.44 38.34 270 top
R28  10k  [R0805]  15.44 45.2 90 top
R29  10k  [R0805]  15.44 53.23 270 top
R30  10k  [R0805]  67.01 50.33 270 top
R31  10k  [R0805]  66.96 42 90 top
R32  10k  [R0805]  67.01 35.8 270 top
R33  10k  [R0805]  67.01 31.74 270 top
R34  10k  [R0805]  35.61 15.38 180 top
R35  10k  [R0805]  40.18 15.38 180 top
R36  10k  [R0805]  50.75 15.38 180 top
R37  10k  [R0805]  45.42 15.38 180 top
R40  1.5kΩ  [R0805]  54.31 32.09 0 top
R41  3.6kΩ  [R0805]  27.69 52.26 225 top
RJ1  R-RJ45R08P-A009  [RJ45-TH_R-RJ45R08P-A009]  48.22 71.52 180 top
RJ2  R-RJ45R08P-A009  [RJ45-TH_R-RJ45R08P-A009]  32.96 71.52 180 top
RJ3  R-RJ45R08P-A009  [RJ45-TH_R-RJ45R08P-A009]  10.33 47.81 270 top
RJ4  R-RJ45R08P-A009  [RJ45-TH_R-RJ45R08P-A009]  10.33 32.53 270 top
RJ5  R-RJ45R08P-A009  [RJ45-TH_R-RJ45R08P-A009]  32.96 10.28 0 top
RJ6  R-RJ45R08P-A009  [RJ45-TH_R-RJ45R08P-A009]  48.22 10.28 0 top
RJ7  R-RJ45R08P-A009  [RJ45-TH_R-RJ45R08P-A009]  71.81 32.53 90 top
RJ8  R-RJ45R08P-A009  [RJ45-TH_R-RJ45R08P-A009]  71.82 47.81 90 top
SW1  -  [SW-SMD_L4.0-W2.9-LS5.0]  58.01 7.05 90 top
U1  ESP-12F(ESP8266MOD)  [WIFIM-SMD_ESP-12F-ESP8266MOD]  25.67 26.09 45 top
U2  TCA9548APWR  [TSSOP-24_L7.8-W4.4-P0.65-LS6.4-BL]  43.03 43.68 270 top
U4  CH340C  [SOP-16_L10.0-W3.9-P1.27-LS6.0-BL]  65.38 16.7 315 top
U6  DW01A  [SOT-23-6_L2.9-W1.6-P0.95-LS2.8-BL]  64.62 60.34 315 top
U8  TP4056  [ESOP-8_L4.9-W3.9-P1.27-LS6.0-BL-EP]  57.66 37.28 0 top
U10  MT9700  [SOT-23-5_L3.0-W1.7-P0.95-LS2.8-BR]  27.18 56.07 225 top
U11  S2B-PH-K-S(LF)(SN)  [CONN-TH_S2B-PH-K-S-LF-SN]  66.45 70.04 135 top
USB1  MC-107DM  [USB-C-SMD_MC-107D]  72.65 9.18 45 top

## Footprints (pads in the part's own frame, mm; a bottom-side part is the same pattern mirrored in y, then rotated)
C0805
  rect 1.41x1.35 smd: 1(-1.03,0) 2(1.03,0)
CONN-TH_S2B-PH-K-S-LF-SN
  rect 1.5x1.4 hole 0.85: 1(1,0)
  round 1.4 hole 0.85: 2(-1,0)
ESOP-8_L4.9-W3.9-P1.27-LS6.0-BL-EP
  rect 0.6x1.2 smd: 1(-1.905,-2.909) 2(-0.635,-2.909) 3(0.635,-2.909) 4(1.905,-2.909) 5(1.905,2.909) 6(0.635,2.909) 7(-0.635,2.909) 8(-1.905,2.909)
  rect 3.5x2.5 smd: 9(0,0)
HDR-F-2.54_1X3
  rect 1.575x1.575 hole 0.889: 1(-2.54,0)
  round 1.575 hole 0.889: 2(0,0)
  round 1.575 hole 0.914: 3(2.54,0)
HDR-M-2.54_1X4
  rect 1.575x1.575 hole 0.889: 1(-3.81,0)
  round 1.575 hole 0.889: 2(-1.27,0) 3(1.27,0) 4(3.81,0)
LED0805_BLUE
  rect 1.3x1.399 smd: 1(-1.05,0) 2(1.05,0)
LED0805_RED
  rect 1.3x1.399 smd: 1(-1.05,0) 2(1.05,0)
R0805
  rect 1.133x1.377 smd: 1(-0.967,0) 2(0.967,0)
RJ45-TH_R-RJ45R08P-A009
  round 1.5 hole 1: 1(3.57,1.27) 2(2.55,-1.27) 3(1.53,1.27) 4(0.51,-1.27) 5(-0.51,1.27) 6(-1.53,-1.27) 7(-2.55,1.27) 8(-3.57,-1.27)
SC-70-6_L2.2-W1.3-P0.65-LS2.1-BR
  rect 0.6x0.42 smd: 1(0.95,-0.65) 2(0.95,0) 3(0.95,0.65) 4(-0.95,0.65) 5(-0.95,0) 6(-0.95,-0.65)
SOD-123FL_L2.8-W1.7-LS3.6-RD
  rect 0.93x0.96 smd: 1(-1.585,0) 2(1.585,0)
SOP-16_L10.0-W3.9-P1.27-LS6.0-BL
  oval 0.56x1.745 smd: 1(-4.445,-2.873) 2(-3.175,-2.873) 3(-1.905,-2.873) 4(-0.635,-2.873) 5(0.635,-2.873) 6(1.905,-2.873) 7(3.175,-2.873) 8(4.445,-2.873) 9(4.445,2.873) 10(3.175,2.873) 11(1.905,2.873) 12(0.635,2.873) 13(-0.635,2.873) 14(-1.905,2.873) 15(-3.175,2.873) 16(-4.445,2.873)
SOT-23-5_L3.0-W1.7-P0.95-LS2.8-BR
  rect 1x0.6 smd: 1(1.3,-0.95) 2(1.3,0) 3(1.3,0.95) 4(-1.3,0.95) 5(-1.3,-0.95)
SOT-23-6_L2.9-W1.6-P0.95-LS2.8-BL
  rect 0.532x1.072 smd: 1(-0.95,-1.149) 2(0,-1.149) 3(0.95,-1.149) 4(0.95,1.149) 5(0,1.149) 6(-0.95,1.149)
SOT-23-6_L2.9-W1.6-P0.95-LS2.8-BR
  rect 1x0.55 smd: 1(1.4,-0.95) 2(1.4,0) 3(1.4,0.95) 4(-1.4,0.95) 5(-1.4,0) 6(-1.4,-0.95)
SOT-25-5_L3.0-W1.8-P0.95-LS3.0-BR
  rect 1.105x0.623 smd: 1(1.397,-0.953) 2(1.397,0.013) 3(1.397,0.953) 4(-1.397,0.953) 5(-1.397,-0.927)
SW-SMD_L4.0-W2.9-LS5.0
  rect 1.529x1.359 smd: 1(-2.034,0) 2(2.034,0)
TSSOP-24_L7.8-W4.4-P0.65-LS6.4-BL
  rect 0.4x1.65 smd: 1(-3.575,-3.022) 2(-2.925,-3.022) 3(-2.275,-3.022) 4(-1.625,-3.022) 5(-0.975,-3.022) 6(-0.325,-3.022) 7(0.325,-3.022) 8(0.975,-3.022) 9(1.625,-3.022) 10(2.275,-3.022) 11(2.925,-3.022) 12(3.575,-3.022) 13(3.575,3.022) 14(2.925,3.022) 15(2.275,3.022) 16(1.625,3.022) 17(0.975,3.022) 18(0.325,3.022) 19(-0.325,3.022) 20(-0.975,3.022) 21(-1.625,3.022) 22(-2.275,3.022) 23(-2.925,3.022) 24(-3.575,3.022)
USB-C-SMD_MC-107D
  oval 1.2x2.5 hole 0.7x1.8: 0(-4.32,1.892) 2(4.32,1.892)
  oval 1.2x2 hole 0.7x1.5: 1(-4.32,-2.308) 3(4.32,-2.308)
  rect 0.6x1.2 smd: A1B12(-3.2,2.308) A4B9(-2.4,2.308) B1A12(3.2,2.308) B4A9(2.4,2.308)
  rect 0.3x1.2 smd: A5(-1.25,2.308) A6(-0.25,2.308) A7(0.25,2.308) A8(1.25,2.308) B5(1.75,2.308) B6(0.75,2.308) B7(-0.75,2.308) B8(-1.75,2.308)
WIFIM-SMD_ESP-12F-ESP8266MOD
  rect 1.4x2.5 smd: 1(-7.651,-7.551) 2(-5.651,-7.551) 3(-3.651,-7.551) 4(-1.651,-7.551) 5(0.349,-7.551) 6(2.349,-7.551) 7(4.349,-7.551) 8(6.349,-7.551) 9(6.349,7.549) 10(4.349,7.55) 11(2.349,7.551) 12(0.349,7.551) 13(-1.651,7.55) 14(-3.651,7.551) 15(-5.651,7.551) 16(-7.651,7.551)
  rect 1.7x1.4 smd: 17(7.651,-5) 18(7.649,-3.002) 19(7.649,-1.004) 20(7.649,0.998) 21(7.649,2.997) 22(7.651,4.997)

## Nets
As in the schematic, except:
GND: C1.2 C2.2 C3.2 C7.2 C8.2 C10.2 C12.2 C14.2 C18.2 C19.2 C20.2 H1.1 J1.2 Q2.1 Q3.2 R3.2 R4.2 R5.1 R8.1 R9.2 R13.2 R20.1 R40.1 R41.2 RJ1.8 RJ2.8 RJ3.8 RJ4.8 RJ5.8 RJ6.8 RJ7.8 RJ8.8 SW1.2 U1.9 U2.12 U4.1 U8.1 U8.3 U8.9 U10.2 USB1.0 USB1.1 USB1.2 USB1.3 USB1.A1B12 USB1.B1A12

Pads without a net: Q2 2 5; Q3 4; RJ1 2 4 5 7; RJ2 2 4 5 7; RJ3 2 4 5 7; RJ4 2 4 5 7; RJ5 2 4 5 7; RJ6 2 4 5 7; RJ7 2 4 5 7; RJ8 2 4 5 7; U1 4 17 18 19 20 21 22; U4 7 8 9 10 11 12 15; U6 4; USB1 A8 B8

## Via types
v1: diameter 0.61, hole 0.305, Top Layer to Bottom Layer, 160 vias
v2: diameter 1.016, hole 0.508, Top Layer to Bottom Layer, 2 vias

## Routing (per net, layer and track width the routed paths; a pad name or vN(x,y) marks a point on that pad's centre or on a via; arc(x,y) is an arc through that point)
3.3V: length 96
  Top Layer w0.254: C1.1 48.52,47.25 U2.24
  Top Layer w0.508: 31.95,17.64 37.53,23.22 ; 37.53,23.22 35.5,25.24 35.5,25.24 36.98,26.73 36.98,28.39 31.98,33.39 R10.1 R19.1 32.69,39.58 R6.1 32.79,39.59 34.42,37.96 ; 37.53,23.22 41.84,23.22 C7.1 Q3.5 47.11,23.05 v1(50.65,23.05) 54.76,23.05 55.64,23.93 59.56,23.93 C8.1 63.84,22.31 64.27,21.88 63.75,21.36 63.75,15.97 U4.4 ; C1.1 48.55,43.94 v1(48.57,43.93)
  Bottom Layer w0.508: v1(50.65,23.05) 50.29,23.41 50.29,42.2 v1(48.57,43.93)
5V: length 371.1
  Top Layer w0.508: C3.1 24.07,54.31 U10.1
  Top Layer w1.016: RJ3.1 15.44,44.24 R28.1 R27.1 ; R33.1 65.84,32.7 65.33,33.21 65.33,36.31 65.79,36.77 R32.1 ; v2(27.84,12.72) 28.92,13.81 30.48,13.81 33.78,17.11 36.93,17.11 37.24,16.8 ; R23.1 R25.1 ; R23.1 44.65,65.06 44.96,64.76 48.01,64.76 48.51,65.26 R2.1 ; R23.1 RJ1.1 ; 37.24,16.8 36.58,16.14 R34.1 36.58,11.6 36.53,11.55 ; 37.24,16.8 40.79,16.8 41.15,16.45 R35.1 ; J1.1 15.44,58.38 15.44,54.19 15.56,54.31 C3.1 ; RJ6.1 51.79,15.3 R36.1 51.72,16.34 51.33,16.73 46.87,16.73 46.38,16.24 46.38,15.38 ; R32.1 67.01,40.98 R31.1 ; R32.1 69.87,36.77 RJ7.1 ; R24.1 29.39,66.36 RJ2.1 ; R26.1 13.43,28.96 RJ4.1 ; R30.1 70.47,51.3 RJ8.1
  Bottom Layer w1.016: RJ1.1 43.84,71.06 43.84,73.44 46.37,75.98 46.37,80.05 ; 46.37,80.05 68.17,80.05 80.11,68.11 80.11,60.94 ; 46.37,80.05 35.1,80.05 28.35,73.29 28.35,71.29 RJ2.1 29.39,70.24 23.67,70.24 16.74,63.31 J1.1 7.42,59.68 2.54,54.8 2.54,49.37 ; 2.54,49.37 2.54,34.13 8.28,28.39 10.77,28.39 11.35,28.96 RJ4.1 v2(27.84,12.72) 27.84,8.17 32.77,3.24 47.4,3.24 52.32,8.17 52.32,11.02 RJ6.1 ; 2.54,49.37 8.79,43.12 10.48,43.12 RJ3.1 ; RJ7.1 71.1,36.67 73.97,36.67 75.49,35.14 78.74,35.14 80.11,36.51 80.11,60.94 ; 80.11,60.94 RJ8.1
+5V: length 81.1
  Top Layer w0.508: USB1.A4B9 68.68,9.75 v1(68.68,10.61) ; U8.8 54.97,40.97 v1(54.97,45.45) 54,46.42 54,52.16 52.48,53.68 D4.2 ; v1(71.43,13.35) 71.87,13.35 USB1.B4A9 ; U8.4 59.6,34.33 C14.1 v1(61.47,32.04) 61.47,40.22 63.6,42.36 63.6,44.49 62.77,45.32 LED1.1 62.77,50.48 62.67,50.58
  Bottom Layer w0.508: v1(62.79,45.3) 62.38,45.71 55.22,45.71 v1(54.97,45.45) ; 68.68,13.35 68.69,13.35 v1(71.43,13.35) ; 68.68,13.35 68.68,24.83 v1(61.47,32.04) ; 68.68,13.35 v1(68.68,10.61)
GND: length 2.2
  Top Layer w0.508: v1(68.1,63.66) v1(68.69,63.07) Q2.1
  vias: v1(2.63,69.65) v1(2.63,64.57) v1(2.63,59.49) v1(2.63,29.01) v1(2.63,23.93) v1(7.71,74.73) v1(7.71,69.65) v1(7.71,64.57) v1(7.71,49.33) v1(7.71,34.09) v1(12.79,79.81) v1(12.79,74.73) v1(12.79,69.65) v1(12.79,64.57) v1(12.79,54.41) v1(12.79,49.33) v1(12.79,39.17) v1(12.79,34.09) v1(17.87,79.81) v1(17.87,69.65) v1(17.87,49.33) v1(17.87,44.25) v1(17.87,39.17) v1(17.87,34.09) v1(22.95,79.81) v1(22.95,74.73) v1(22.95,59.49) v1(22.95,49.33) v1(22.95,44.25) v1(22.95,23.93) v1(22.95,3.61) v1(28.03,79.81) v1(28.03,44.25) v1(28.03,3.61) v1(33.11,79.81) v1(33.11,74.73) v1(33.11,59.49) v1(33.11,54.41) v1(33.11,49.33) v1(33.11,13.77) v1(38.19,34.09) v1(38.19,29.01) v1(38.19,13.77) v1(38.56,40.07) v1(43.27,69.65) v1(43.27,64.57) v1(48.35,74.73) v1(48.35,59.49) v1(48.35,49.33) v1(48.35,39.17) v1(53.43,69.65) v1(53.43,64.57) v1(53.43,59.49) v1(53.43,39.17) v1(53.43,34.09) v1(53.43,29.01) v1(53.43,23.93) v1(53.43,18.84) v1(53.43,13.77) v1(53.43,8.69) v1(53.43,3.61) v1(58.51,74.73) v1(58.51,69.65) v1(58.51,64.57) v1(58.51,59.49) v1(58.51,49.33) v1(58.51,29.01) v1(58.51,18.84) v1(63.59,69.65) v1(63.59,64.57) v1(63.59,54.41) v1(63.59,49.33) v1(63.59,39.17) v1(63.59,34.09) v1(63.59,23.93) v1(63.59,8.69) v1(63.59,3.61) v1(68.67,74.73) v1(68.67,54.41) v1(68.67,44.25) v1(68.67,39.17) v1(68.67,34.09) v1(73.75,69.65) v1(73.75,59.49) v1(73.75,39.17) v1(73.75,23.93) v1(73.75,18.84) v1(73.75,8.69) v1(73.75,3.61) v1(78.83,64.57) v1(78.83,54.41) v1(78.83,49.33) v1(78.83,44.25) v1(78.83,39.17) v1(78.83,34.09) v1(78.83,29.01) v1(78.83,23.93) v1(78.83,18.84) v1(78.83,8.69)
B+: length 66.5
  Top Layer w0.508: v1(59.59,46.42) 59.59,43.81 59.55,43.78 59.56,43.77 U8.5 ; v1(59.59,53.33) 59.58,53.33 R22.1 56.75,54.65 46.75,54.65 D1.2 ; R11.2 73.05,61.11 73.05,66.03 68.33,70.75 U11.1
  Bottom Layer w0.508: v1(59.59,46.42) v1(59.59,53.33) 59.59,64.6 U11.1
B-: length 12.4
  Top Layer w0.508: 68.38,65.4 67.96,65.82 66.8,65.82 64.76,63.78 U6.6 ; 68.38,65.4 Q2.3 ; 68.38,65.4 C13.2 67.36,69.33 U11.2
CHRG#: length 11.7
  Top Layer w0.508: U8.7 57.02,44.77 54.97,46.83 54.97,49.37 R14.2
D7: length 28
  Top Layer w0.254: v1(41.45,45.05) 41.45,45.71 41.21,45.95 U2.3 ; v1(32.26,26.4) 32.26,25.66 U1.7
  Bottom Layer w0.254: v1(41.45,45.05) 41.45,38.94 32.26,29.74 v1(32.26,26.4)
D+: length 11.3
  Top Layer w0.254: 70.11,11.37 70.53,11.8 71.09,11.8 USB1.B6 ; 70.11,11.37 USB1.A6 ; 70.11,11.37 66.09,15.38 64.97,15.38 63.81,14.22 U4.5
D-: length 11.2
  Top Layer w0.254: USB1.A7 71.2,10.99 71.88,10.3 71.88,9.84 71.63,9.59 71.18,9.59 USB1.B7 66.3,14.47 65.84,14.47 U4.6
DTR: length 10.9
  Top Layer w0.254: v1(62.59,13.09) 62.02,12.53 62.02,12.5 62.38,12.13 62.38,11.21 62.9,10.7 ; v1(65.79,16.29) 65.79,18.01 U4.13
  Bottom Layer w0.254: v1(65.79,16.29) v1(62.59,13.09)
GPI0: length 70.9
  Top Layer w0.254: v1(60.71,9.44) 61.37,8.78 62.74,8.78 64.18,10.21 64.18,10.34 Q1.3 ; v1(30.23,39.87) 30.23,39.87 R6.2 ; U1.12 21.89,30.37 v1(22.81,30.37) ; v1(49.28,18.12) 48.77,18.63 v1(38.3,18.63)
  Bottom Layer w0.254: v1(49.28,18.12) 52.02,18.12 v1(60.71,9.44) ; v1(30.23,39.87) 30.23,37.12 23.47,30.37 v1(22.81,30.37) 30.07,23.1 36.32,23.1 38.3,21.12 v1(38.3,18.63)
GPI2: length 11.2
  Top Layer w0.254: 21.99,33.09 23.15,31.94 v1(24.08,31.94) ; v1(27.64,37.28) 28.95,38.59 R19.2
  Bottom Layer w0.254: v1(27.64,37.28) 27.64,35.5 v1(24.08,31.94)
GPI015: length 5.8
  Top Layer w0.508: 23.14,38.93 21.59,37.38 21.59,36.31 23.4,34.51 U1.10
RPROG: length 3
  Top Layer w0.508: U8.2 57.02,33.85 R40.2
RST: length 49.6
  Top Layer w0.254: Q1.6 59.13,9.61 59.13,6.21 58.01,5.1 SW1.1 56.93,3.93 C19.1 33.07,2.99 26.62,9.44 26.62,14.32 U1.1
RTS: length 12.4
  Top Layer w0.254: Q1.1 61.93,10.75 61.93,11.67 Q1.5 61.22,12.38 61.22,12.59 64.67,16.04 64.67,18.68 66.06,20.08
RX: length 49.6
  Top Layer w0.254: v1(19.2,25.59) 18.18,25.59 U1.15 ; v1(36.98,21.37) 37.03,21.32 54.76,21.32 59.69,16.4 60.59,16.4 U4.2
  Bottom Layer w0.254: v1(19.2,25.59) 25.71,25.59 29.92,21.37 v1(36.98,21.37)
SC0: length 45.8
  Top Layer w0.254: RJ1.6 49.83,72.79 51.82,70.8 51.82,69.23 50.55,67.96 50.55,66.33 ; U2.5 38.04,44.65 v1(37.95,44.74)
  Bottom Layer w0.254: v1(37.95,44.74) 37.95,57.34 47.58,66.97 49.56,66.97 51.82,69.23 51.82,70.8 49.83,72.79 RJ1.6
SC1: length 43.6
  Top Layer w0.254: U2.7 36.65,43.35 v1(36.63,43.37) ; 38.05,66.33 38.05,69.23 RJ2.6
  Bottom Layer w0.254: RJ2.6 36.54,70.74 36.54,69.39 34.09,66.94 34.09,45.91 v1(36.63,43.37)
SC2: length 42.3
  Top Layer w0.254: U2.9 36.12,42.05 v1(34.29,40.22) ; 9.06,34.06 12.37,37.38 R27.2
  Bottom Layer w0.254: v1(34.29,40.22) 33.88,40.63 15.63,40.63 9.06,34.06
SC3: length 44.3
  Top Layer w0.254: v1(37.54,40.17) 38.12,40.75 U2.11 ; R29.2 11.99,52.26 9.07,49.34 9.06,49.34
  Bottom Layer w0.254: v1(37.54,40.17) 26.32,51.4 11.13,51.4 9.07,49.34 9.06,49.34
SC4: length 38.7
  Top Layer w0.254: R31.2 69.78,42.97 RJ8.6 ; U2.14 50.06,40.75 53.24,43.93 v1(53.24,44.69)
  Bottom Layer w0.254: RJ8.6 73.06,46.28 69.75,42.96 54.97,42.96 v1(53.24,44.69)
SC5: length 45.9
  Top Layer w0.254: v1(51.21,44.69) 50.5,44.69 47.86,42.05 U2.16 ; R33.2 68.94,28.84 70.97,28.84 73.08,30.95 RJ7.6
  Bottom Layer w0.254: v1(51.21,44.69) 51.21,43.12 54.46,39.87 61.88,39.87 69.29,32.45 69.29,29.71 70.16,28.84 70.97,28.84 73.08,30.95 RJ7.6
SC6: length 62.5
  Top Layer w0.254: U2.18 44.79,43.35 44.04,42.6 v1(44.04,37.17) ; R35.2 39.22,9.94 36.63,7.35 33.09,7.35 RJ5.6
  Bottom Layer w0.254: v1(44.04,37.17) 42.32,37.17 40.39,35.24 40.39,11.11 36.63,7.35 33.07,7.35 31.43,9 RJ5.6
SC7: length 55.4
  Top Layer w0.254: U2.20 44.61,44.65 42.67,42.71 42.67,35.65 41.71,34.68 v1(41.71,33.47) ; RJ6.6 46.67,9.01 45.37,7.71 43.99,7.71 43.38,8.32 43.38,14.31 R37.2
  Bottom Layer w0.254: v1(41.71,33.47) 41.71,10 43.99,7.71 45.37,7.71 46.67,9.01 RJ6.6
SCL: length 78.7
  Top Layer w0.254: R10.2 33.4,34.2 v1(34.65,32.96) 35.92,32.96 42.01,39.05 42.01,42.96 v1(44.39,45.35) 45,45.95 U2.22 ; v1(41.15,49.72) 41.15,58.1 35.98,63.27 20.33,63.27 ; v1(27.08,28.59) 24.79,26.3 20.3,26.3 U1.14
  Bottom Layer w0.254: v1(34.65,32.96) 31.45,32.96 v1(27.08,28.59) ; v1(44.39,45.35) 41.15,48.59 v1(41.15,49.72)
SD0: length 35.3
  Top Layer w0.254: v1(36.48,47.59) 36.48,47.57 38.75,45.3 40.01,45.3 ; RJ1.3 46.69,66.44 R23.2
  Bottom Layer w0.254: RJ1.3 36.48,60.03 v1(36.48,47.59)
SD1: length 36.7
  Top Layer w0.254: R24.2 31.35,70.16 RJ2.3 ; v1(32.36,47.44) 32.36,46.67 35.03,44 U2.6
  Bottom Layer w0.254: RJ2.3 31.45,70.23 31.45,48.35 v1(32.36,47.44)
SD2: length 37.9
  Top Layer w0.254: RJ4.3 13.54,31 R26.2 ; U2.8 39.97,42.66 30.89,42.66 v1(26.42,38.19)
  Bottom Layer w0.254: RJ4.3 15.99,35.4 23.62,35.4 v1(26.42,38.19)
SD3: length 35.3
  Top Layer w0.254: RJ3.3 15.33,46.28 R28.2 ; U2.10 37.3,41.4 v1(36.07,40.17)
  Bottom Layer w0.254: v1(36.07,40.17) 29.96,46.28 RJ3.3
SD4: length 33.2
  Top Layer w0.254: U2.13 51.59,40.1 54.2,42.71 v1(54.2,44.69) ; RJ8.3 67.34,49.34 66.96,48.96
  Bottom Layer w0.254: RJ8.3 67.94,49.34 63.3,44.69 v1(54.2,44.69)
SD5: length 34.5
  Top Layer w0.254: v1(52.17,44.69) 48.88,41.4 U2.15 ; R32.2 69.76,34.84 RJ7.3
  Bottom Layer w0.254: v1(52.17,44.69) 52.17,44.03 54.71,41.49 63.09,41.49 70.52,34.06 RJ7.3
SD6: length 42
  Top Layer w0.254: U2.17 44.79,42.7 44.7,42.61 v1(44.7,38.85) ; RJ5.3 34.65,11.71 R34.2
  Bottom Layer w0.254: v1(44.7,38.85) 42.32,38.85 39.12,35.65 39.12,16.18 RJ5.3
SD7: length 40.8
  Top Layer w0.254: R36.2 49.78,11.58 RJ6.3 ; v1(43.38,34.48) 43.38,42.66 44.73,44 U2.19
  Bottom Layer w0.254: v1(43.38,34.48) 43.38,17.92 RJ6.3
SDA: length 74.7
  Top Layer w0.254: U1.13 21,28.43 23.72,28.43 v1(25.3,30.01) ; 46.05,46.6 44.79,46.6 ; 44.79,46.6 44.79,48.06 43.49,49.37 43.49,59.63 38.05,65.06 22.13,65.06 ; 44.79,46.6 44.12,46.6 41.45,43.93 41.45,39.87 40.95,39.36 38.55,39.36 R12.2 35.79,36.59 v1(34.65,35.45)
  Bottom Layer w0.254: v1(25.3,30.01) 30.73,35.45 v1(34.65,35.45)
STDBY#: length 8.5
  Top Layer w0.508: R15.2 58.29,45.73 U8.6
TX: length 49.3
  Top Layer w0.254: v1(35.92,19.34) 51.82,19.34 58.35,12.82 R21.1 ; 14.92,26.02 21.6,19.34 v1(24.69,19.34)
  Bottom Layer w0.254: v1(24.69,19.34) v1(35.92,19.34)
$1N65: length 9
  Top Layer w0.254: R4.1 36.98,52.77 35.87,51.65 35.87,49.77 39.04,46.6 40.01,46.6
$1N66: length 4.4
  Top Layer w0.254: U2.1 37.08,50.17 R3.1
$1N67: length 22.9
  Top Layer w0.254: 37.03,55 37.03,55.97 37.69,56.63 v1(39.07,56.63) ; 46.05,45.3 47.4,45.3 v1(47.75,45.66)
  Bottom Layer w0.254: v1(47.75,45.66) 47.75,53.43 44.55,56.63 v1(39.07,56.63)
$2N78: length 6.8
  Top Layer w0.254: R8.2 76.27,12.91 74.93,11.57 72.73,11.57 72.26,12.05
$2N79: length 7.3
  Top Layer w0.254: R9.1 68.89,5.58 70.61,7.3 70.61,9.44 70.13,9.92 USB1.A5
$2N179: length 2.6
  Top Layer w0.508: R15.1 60.62,47.84 LED1.2
$2N191: length 2.5
  Top Layer w0.508: R14.1 60.52,50.53 60.57,50.58
$2N237: length 6.6
  Top Layer w0.508: Q2.6 67.51,61.89 v1(67.51,60.64) ; v1(66.19,58.1) 65.23,58.1 U6.3
  Bottom Layer w0.508: v1(66.19,58.1) 67.51,59.42 v1(67.51,60.64)
$2N238: length 5.6
  Top Layer w0.508: v1(63.55,62.42) 63.13,62 U6.1 ; Q2.4 65.66,62.73 v1(65.63,62.73)
  Bottom Layer w0.508: v1(63.55,62.42) 65.33,62.42 v1(65.63,62.73)
$2N249: length 12.4
  Top Layer w0.508: U6.5 65.43,61.1 64.87,60.54 64.87,60.29 65.81,59.35 R11.1 71.29,62.08 C13.1
$2N267: length 2.5
  Top Layer w0.508: 62.06,57.77 63.81,59.52 U6.2
$3N452: length 3
  Top Layer w0.508: 28.39,18.13 R7.2 30.54,15.98
$3N457: length 2.6
  Top Layer w0.254: R21.2 61.95,16.02 U4.3
$3N474: length 62.3
  Top Layer w0.254: U1.2 27.07,16.76 v1(28.55,15.28) ; v1(34.09,18.22) 37.44,18.22 37.95,17.72 v1(45.21,17.72) ; v1(55.07,52.01) 55.07,52.26 R22.2
  Bottom Layer w0.254: v1(34.09,18.22) 31.5,18.22 v1(28.55,15.28) ; v1(45.21,17.72) 46.99,17.72 51.24,21.96 51.24,42.38 50.19,43.42 50.19,47.13 v1(55.07,52.01)
$3N12959: length 45
  Top Layer w0.508: 28.77,56.32 28.81,56.32 30.89,54.24 30.89,50.38 v1(36.12,45.15) ; v2(45.82,38.85) 46.59,38.09 H1.2 48.29,33.39 Q3.3
  Bottom Layer w0.508: v2(45.82,38.85) 42.47,42.2 42.47,45.66 41.71,46.42 40.64,46.42 39.83,45.61 39.83,44.54 38.76,43.47 37.8,43.47 v1(36.12,45.15)
$3N13001: length 61.4
  Top Layer w0.508: 27.43,57.66 28.89,59.12 C2.1 30.5,61.3 36.12,61.3 40.44,56.99 v1(40.44,55.97) ; 45.77,49.01 D1.1 D4.1 ; 44.79,33.29 46.89,31.19 46.89,25.29 47.54,24.64 Q3.1 50.67,24.64 C20.1
  Bottom Layer w0.508: 44.79,33.29 44.81,33.31 44.81,35.5 46.79,37.48 46.79,47.99 v1(45.77,49.01) 40.44,54.34 v1(40.44,55.97)
$3N14474: length 2.1
  Top Layer w0.508: U10.3 26.93,54.38 R41.1

## Copper pours and planes (outline as drawn; the poured copper is in the pictures)
5V on Top Layer: 22.45,56.99 26.16,56.99 26.16,53.33 22.45,53.33
GND on Top Layer: -17.69,100.99 94.48,100.99 94.48,-21.79 -17.69,-21.79
GND on Bottom Layer: -10.31,95.29 90.27,95.29 90.27,-15.56 -10.31,-15.56
$3N13001 on Top Layer: 26.26,60.69 29.88,60.69 29.88,57.09 26.26,57.09
$3N14474 on Top Layer: 26.26,55.06 29.26,55.06 29.26,52.06 26.26,52.06

## Text on the board
Bottom Silkscreen Layer: Design by KeonMan PCB by Holylemon | OctoSlime MKII
